# EAGLE design Final (EAGLE 9.6.2)

## Sheet 1 of 6: POWER
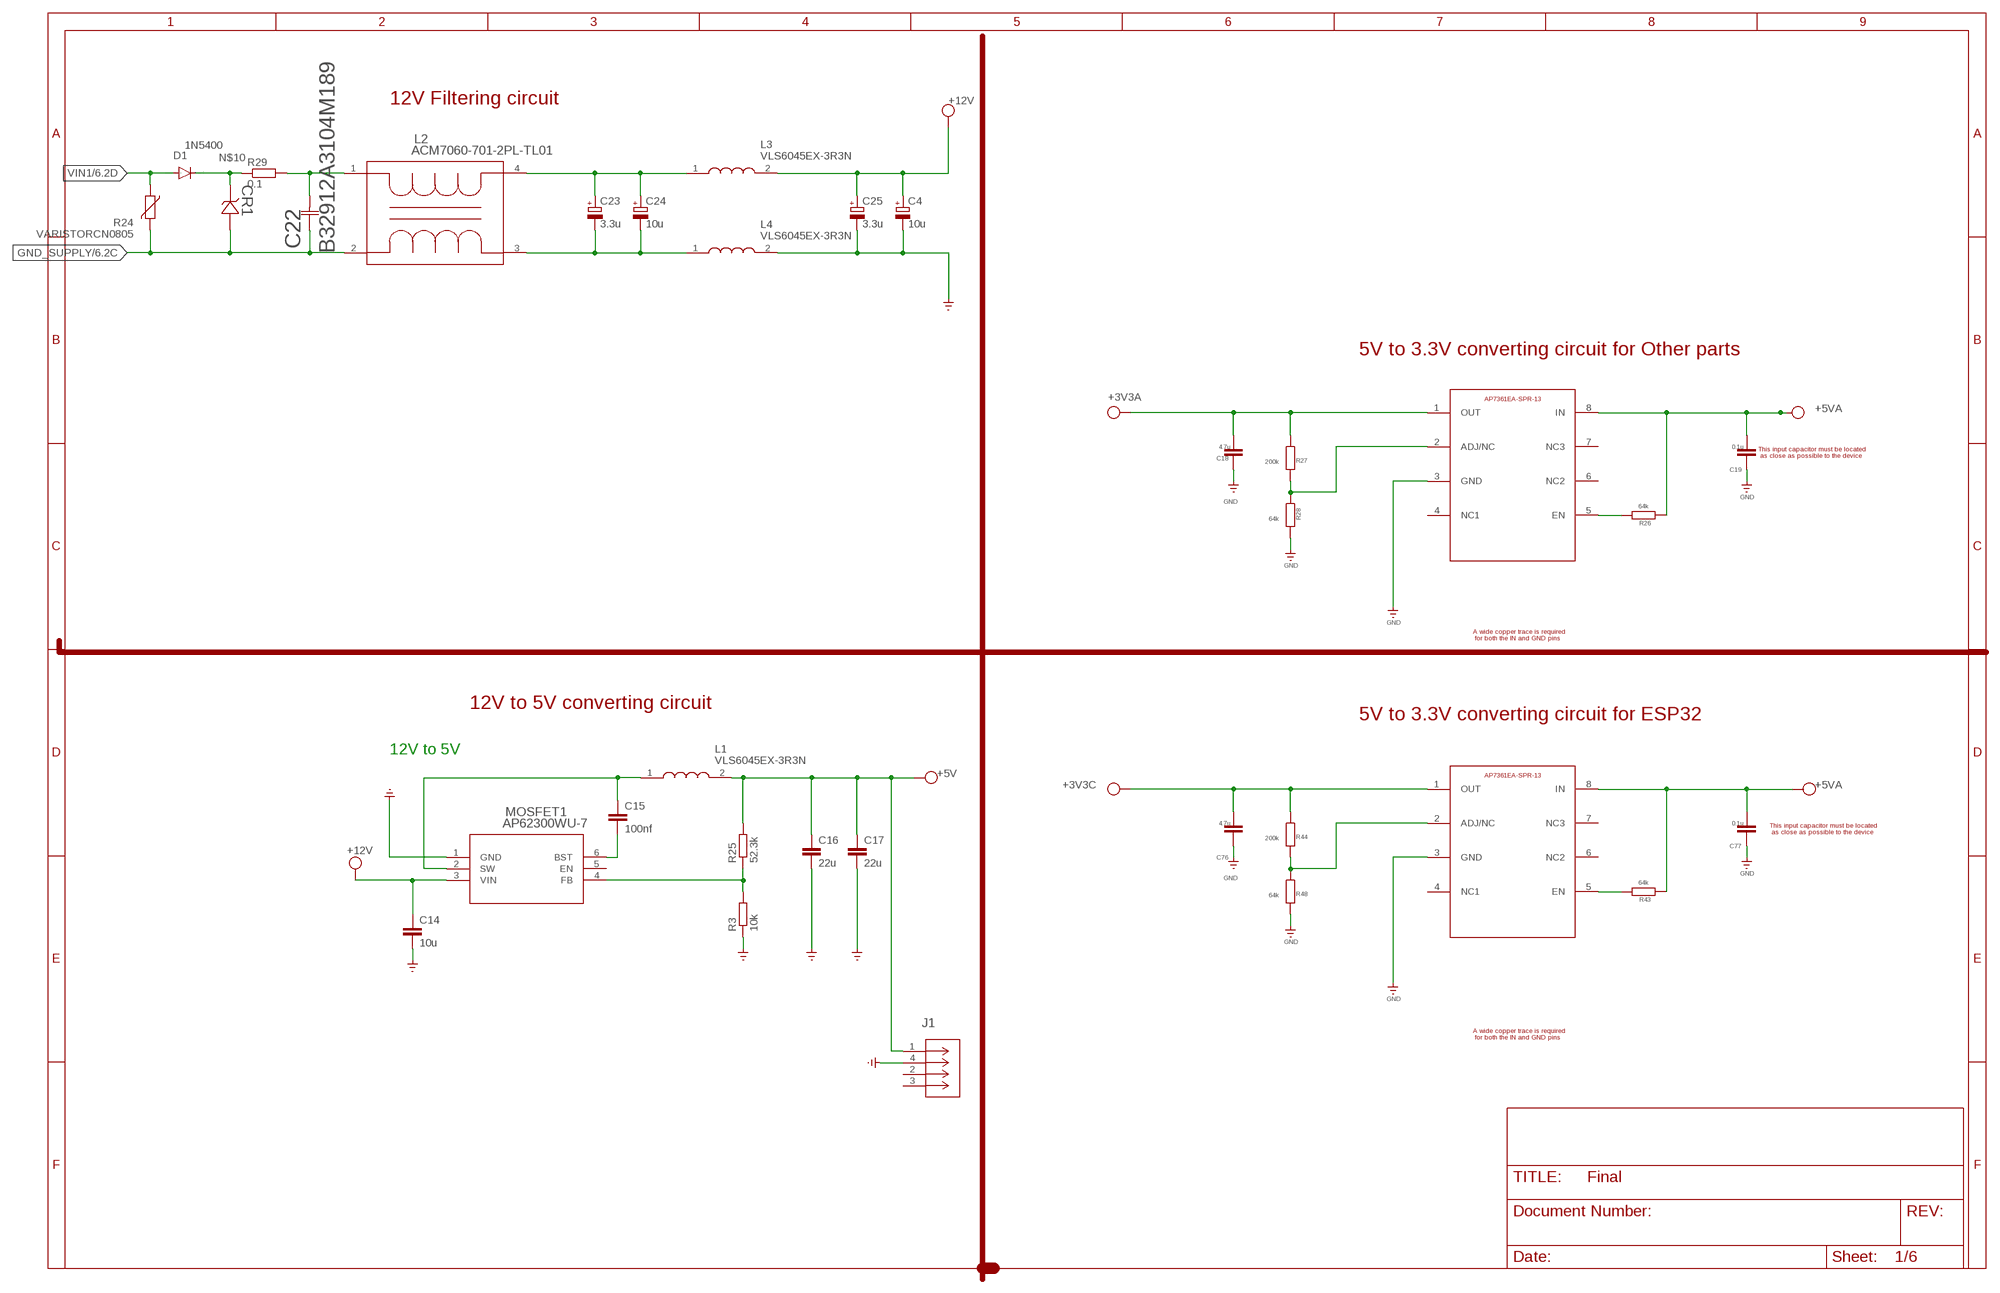
[diagram p0: schematic, sheet 1]

### Parts
C4  10u  CPOL-EUE2.5-5  [E2,5-5]
C14  10u  C-EUC0805  [C0805]
C15  100nf  C-EUC0805  [C0805]
C16  22u  C-EUC0805  [C0805]
C17  22u  C-EUC0805  [C0805]
C18  4.7u  C-EUC0805  [C0805]
C19  0.1u  C-EUC0805  [C0805]
C22  B32912A3104M189  [CAP_B32912A--15--7X12.5X18_TDK]
C23  3.3u  CPOL-EUE2.5-5  [E2,5-5]
C24  10u  CPOL-EUE2.5-5  [E2,5-5]
C25  3.3u  CPOL-EUE2.5-5  [E2,5-5]
C76  4.7u  C-EUC0805  [C0805]
C77  0.1u  C-EUC0805  [C0805]
CR1  SM6T15ASMB_STM-L  [SMB_STM-L]
D1  1N5400  [DO201-15]
J1  USB1130-15-A  [CONN4_USB1130-15-A_GCT]
L1  VLS6045EX-3R3N  [VLS6045]
L2  ACM7060-701-2PL-TL01  [IND_ACM7060_TDK]
L3  VLS6045EX-3R3N  [VLS6045]
L4  VLS6045EX-3R3N  [VLS6045]
MOSFET1  AP62300WU-7  [TSOT26_DIO]
R3  10k  R-EU_R0805  [R0805]
R24  VARISTORCN0805  [CT/CN0805]
R25  52.3k  R-EU_R0805  [R0805]
R26  64k  R-EU_R0805  [R0805]
R27  200k  R-EU_R0805  [R0805]
R28  64k  R-EU_R0805  [R0805]
R29  0.1  R-EU_R1206  [R1206]
R43  64k  R-EU_R0805  [R0805]
R44  200k  R-EU_R0805  [R0805]
R48  64k  R-EU_R0805  [R0805]
U$1  AP7361EASMD  [AP7361EA]
U$12  AP7361EASMD  [AP7361EA]

### Nets
+3V3A: C18.1 R27.1 U$1.1(OUT) ; supply symbol labelled VCC ; also sheet 2,3,4,5,6
+3V3C: C76.1 R44.1 U$12.1(OUT) ; supply symbol labelled VCC ; also sheet 2
+5V: C16.1 C17.1 J1.1 L1.2 R25.2 ; supply symbol labelled VCC ; also sheet 2
+5VA: C19.1 C77.1 R26.1 R43.1 U$1.8(IN) U$12.8(IN) ; supply symbol labelled VCC ; also sheet 2,6
+12V: C4.+ C14.1 C25.+ L3.2 MOSFET1.3(VIN) ; supply symbol labelled VCC ; also sheet 6
GND: C4.- C14.2 C16.2 C17.2 C18.2 C19.2 C25.- C76.2 C77.2 J1.4 L4.2 MOSFET1.1(GND) R3.1 R28.2 R48.2 U$1.3(GND) U$12.3(GND) ; supply symbol labelled SUPPLY0_GND_ ; also sheet 2,3,4,5,6
GND_SUPPLY: C22.1 CR1.2 L2.2 R24.2 ; also sheet 6
N$10: CR1.1 D1.C R29.1
N$12: C23.+ C24.+ L2.4 L3.1
N$14: C23.- C24.- L2.3 L4.1
N$16: MOSFET1.4(FB) R3.2 R25.1
N$17: C15.1 L1.1 MOSFET1.2(SW)
N$18: C15.2 MOSFET1.6(BST)
N$21: R26.2 U$1.5(EN)
N$22: R27.2 R28.1 U$1.2(ADJ/NC)
N$25: R43.2 U$12.5(EN)
N$30: R44.2 R48.1 U$12.2(ADJ/NC)
VIN: C22.2 L2.1 R29.2
VIN1: D1.A R24.1 ; also sheet 6
Unconnected: J1.2 J1.3 MOSFET1.5(EN) U$1.4(NC1) U$1.6(NC2) U$1.7(NC3) U$12.4(NC1) U$12.6(NC2) U$12.7(NC3)

### Notes on the sheet
- 12V Filtering circuit
- 5V to 3.3V converting circuit for Other parts
- This input capacitor must be located
   as close as possible to the device
- A wide copper trace is required
   for both the IN and GND pins
- 12V to 5V converting circuit
- 5V to 3.3V converting circuit for ESP32
- 12V to 5V
- This input capacitor must be located
   as close as possible to the device
- A wide copper trace is required
   for both the IN and GND pins

## Sheet 2 of 6: ESP32
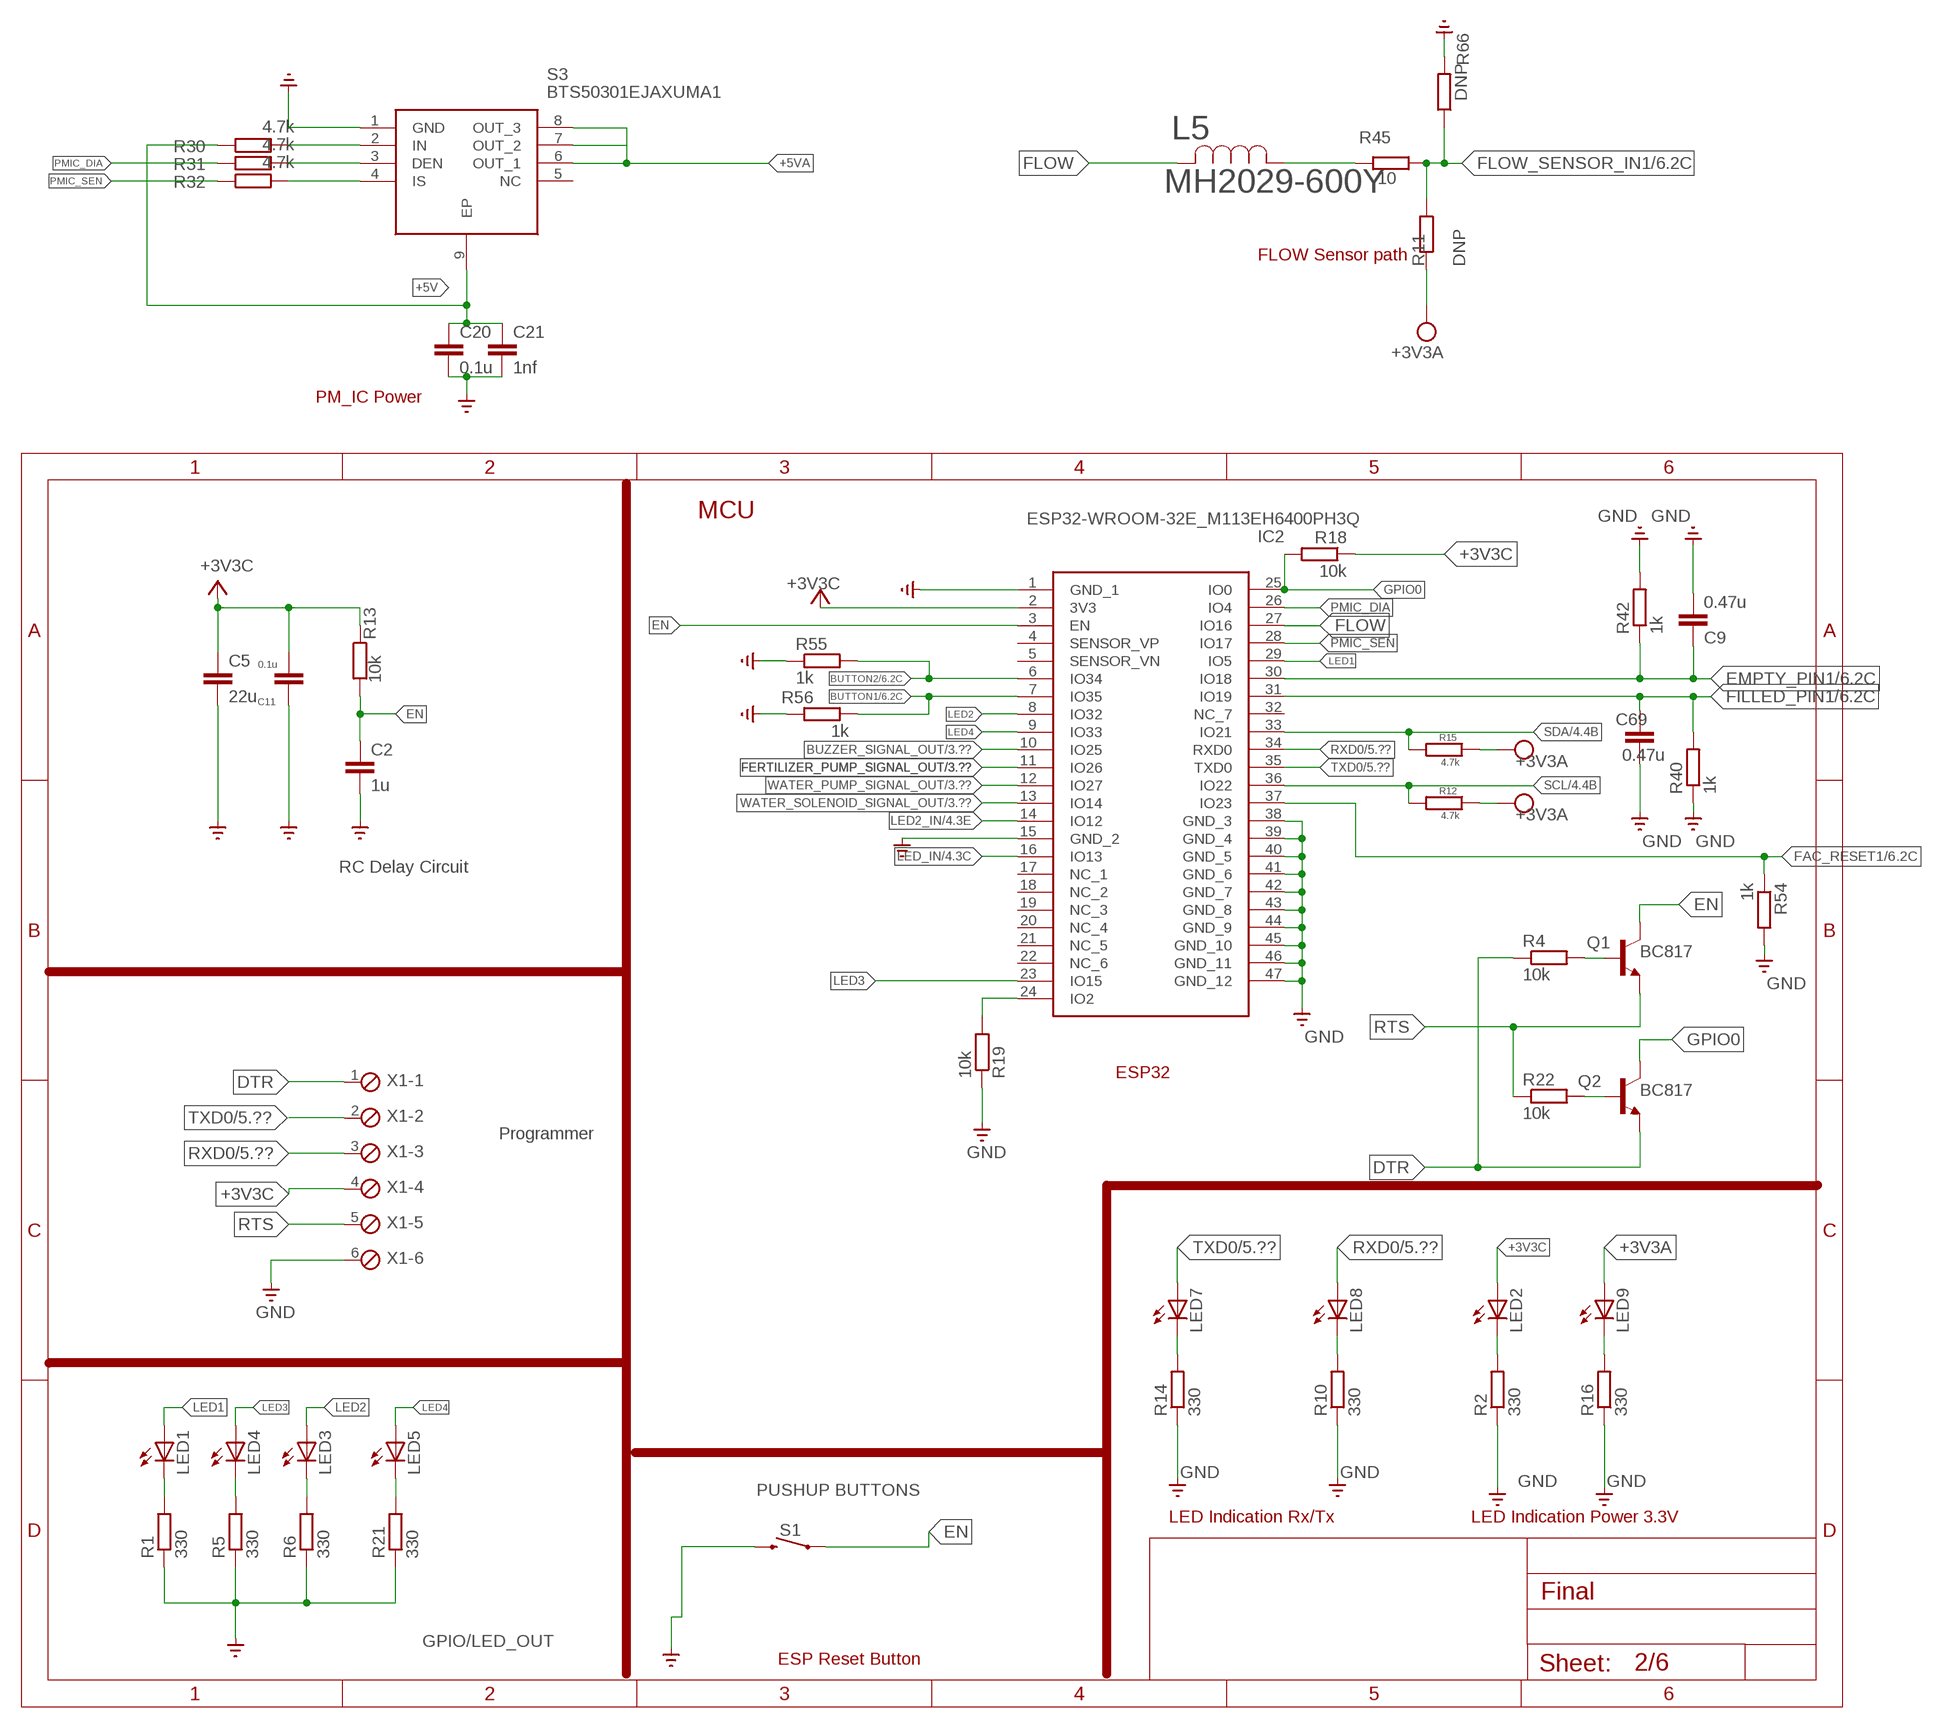
[diagram p1: schematic, sheet 2]

### Parts
C2  1u  C-EUC0805  [C0805]
C5  22u  C-EUC0805  [C0805]
C9  0.47u  C-EUC0805  [C0805]
C11  0.1u  C-EUC0805  [C0805]
C20  0.1u  C-EUC0805  [C0805]
C21  1nf  C-EUC0805  [C0805]
C69  0.47u  C-EUC0805  [C0805]
IC2  ESP32-WROOM-32E_M113EH6400PH3Q  [ESP32WROOM32EM113EH6400PH3Q0]
L5  MH2029-600Y  [IND_BOURNS_MH2029]
LED1  LEDCHIP-LED0603  [CHIP-LED0603]
LED2  LEDCHIP-LED0603  [CHIP-LED0603]
LED3  LEDCHIP-LED0603  [CHIP-LED0603]
LED4  LEDCHIP-LED0603  [CHIP-LED0603]
LED5  LEDCHIP-LED0603  [CHIP-LED0603]
LED7  LEDCHIP-LED0603  [CHIP-LED0603]
LED8  LEDCHIP-LED0603  [CHIP-LED0603]
LED9  LEDCHIP-LED0603  [CHIP-LED0603]
Q1  BC817  [SOT95P230X110-3N]
Q2  BC817  [SOT95P230X110-3N]
R1  330  R-EU_R0805  [R0805]
R2  330  R-EU_R0805  [R0805]
R4  10k  R-EU_R0805  [R0805]
R5  330  R-EU_R0805  [R0805]
R6  330  R-EU_R0805  [R0805]
R10  330  R-EU_R0805  [R0805]
R11  DNP  R-EU_R0805  [R0805]
R12  4.7k  R-EU_R0805  [R0805]
R13  10k  R-EU_R0805  [R0805]
R14  330  R-EU_R0805  [R0805]
R15  4.7k  R-EU_R0805  [R0805]
R16  330  R-EU_R0805  [R0805]
R18  10k  R-EU_R0805  [R0805]
R19  10k  R-EU_R0805  [R0805]
R21  330  R-EU_R0805  [R0805]
R22  10k  R-EU_R0805  [R0805]
R30  4.7k  R-EU_R0805  [R0805]
R31  4.7k  R-EU_R0805  [R0805]
R32  4.7k  R-EU_R0805  [R0805]
R40  1k  R-EU_R0805  [R0805]
R42  1k  R-EU_R0805  [R0805]
R45  10  R-EU_R0805  [R0805]
R54  1k  R-EU_R0805  [R0805]
R55  1k  R-EU_R0805  [R0805]
R56  1k  R-EU_R0805  [R0805]
R66  DNP  R-EU_R0805  [R0805]
S1  MOMENTARY-SWITCH-SPST-SMD-6.2MM-TALL  [TACTILE_SWITCH_SMD_6.2MM_TALL]
S3  BTS50301EJAXUMA1  [SOIC127P600X170-9N]
X1  MPT6  [6POL254]

### Nets
+3V3A: LED9.A R11.2 R12.1 R15.1 ; supply symbol labelled VCC ; also sheet 1,3,4,5,6
+3V3C: C5.1 C11.2 IC2.2(3V3) LED2.A R13.1 R18.1 X1.4 ; supply symbol labelled +3V3 ; also sheet 1
+5V: C20.1 C21.1 R30.1 S3.9(EP) ; also sheet 1
+5VA: S3.6(OUT_1) S3.7(OUT_2) S3.8(OUT_3) ; also sheet 1,6
BUTTON1: IC2.7(IO35) R56.1 ; also sheet 6
BUTTON2: IC2.6(IO34) R55.2 ; also sheet 6
BUZZER_SIGNAL_OUT: IC2.10(IO25) ; also sheet 3
DTR: Q2.2(E) R4.1 X1.1
EMPTY_PIN1: C9.1 IC2.30(IO18) R42.1 ; also sheet 6
EN: C2.1 IC2.3(EN) Q1.3(C) R13.2 S1.A2
FAC_RESET1: IC2.37(IO23) R54.1 ; also sheet 6
FERTILIZER_PUMP_SIGNAL_OUT: IC2.11(IO26) ; also sheet 3,6
FILLED_PIN1: C69.1 IC2.31(IO19) R40.2 ; also sheet 6
FLOW: IC2.27(IO16) L5.2
FLOW_SENSOR_IN1: R11.1 R45.1 R66.1 ; also sheet 6
GND: C2.2 C5.2 C9.2 C11.1 C20.2 C21.2 C69.2 IC2.1(GND_1) IC2.15(GND_2) IC2.38(GND_3) IC2.39(GND_4) IC2.40(GND_5) IC2.41(GND_6) IC2.42(GND_7) IC2.43(GND_8) IC2.44(GND_9) IC2.45(GND_10) IC2.46(GND_11) IC2.47(GND_12) R1.1 R2.1 R5.1 R6.1 R10.1 R14.1 R16.1 R19.1 R21.1 R40.1 R42.2 R54.2 R55.1 R56.2 R66.2 S1.B2 S3.1(GND) X1.6 ; supply symbol labelled SUPPLY0_GND_ ; also sheet 1,3,4,5,6
GPIO0: IC2.25(IO0) Q2.3(C) R18.2
LED1: IC2.29(IO5) LED1.A
LED2: IC2.8(IO32) LED3.A
LED2_IN: IC2.14(IO12) ; also sheet 4
LED3: IC2.23(IO15) LED4.A
LED4: IC2.9(IO33) LED5.A
LED_IN: IC2.16(IO13) ; also sheet 4
N$1: LED2.C R2.2
N$2: LED1.C R1.2
N$3: L5.1 R45.2
N$4: LED3.C R6.2
N$5: Q1.1(B) R4.2
N$6: IC2.24(IO2) R19.2
N$7: LED4.C R5.2
N$8: Q2.1(B) R22.2
N$26: LED5.C R21.2
N$32: R30.2 S3.2(IN)
N$34: R31.2 S3.3(DEN)
N$35: R32.2 S3.4(IS)
N$36: LED7.C R14.2
N$37: LED8.C R10.2
N$42: LED9.C R16.2
PMIC_DIA: IC2.26(IO4) R31.1
PMIC_SEN: IC2.28(IO17) R32.1
RTS: Q1.2(E) R22.1 X1.5
RXD0: IC2.34(RXD0) LED8.A X1.3 ; also sheet 5
SCL: IC2.36(IO22) R12.2 ; also sheet 4,6
SDA: IC2.33(IO21) R15.2 ; also sheet 4,6
TXD0: IC2.35(TXD0) LED7.A X1.2 ; also sheet 5
WATER_PUMP_SIGNAL_OUT: IC2.12(IO27) ; also sheet 3,6
WATER_SOLENOID_SIGNAL_OUT: IC2.13(IO14) ; also sheet 3,6
Unconnected: IC2.4(SENSOR_VP) IC2.5(SENSOR_VN) IC2.17(NC_1) IC2.18(NC_2) IC2.19(NC_3) IC2.20(NC_4) IC2.21(NC_5) IC2.22(NC_6) IC2.32(NC_7) S3.5(NC)

### Notes on the sheet
- FLOW Sensor path
- PM_IC Power
- MCU
- RC Delay Circuit
- ESP32
- Programmer
- PUSHUP BUTTONS
- LED Indication Rx/Tx | LED Indication Power 3.3V
- GPIO/LED_OUT
- ESP Reset Button

## Sheet 3 of 6: Drivers
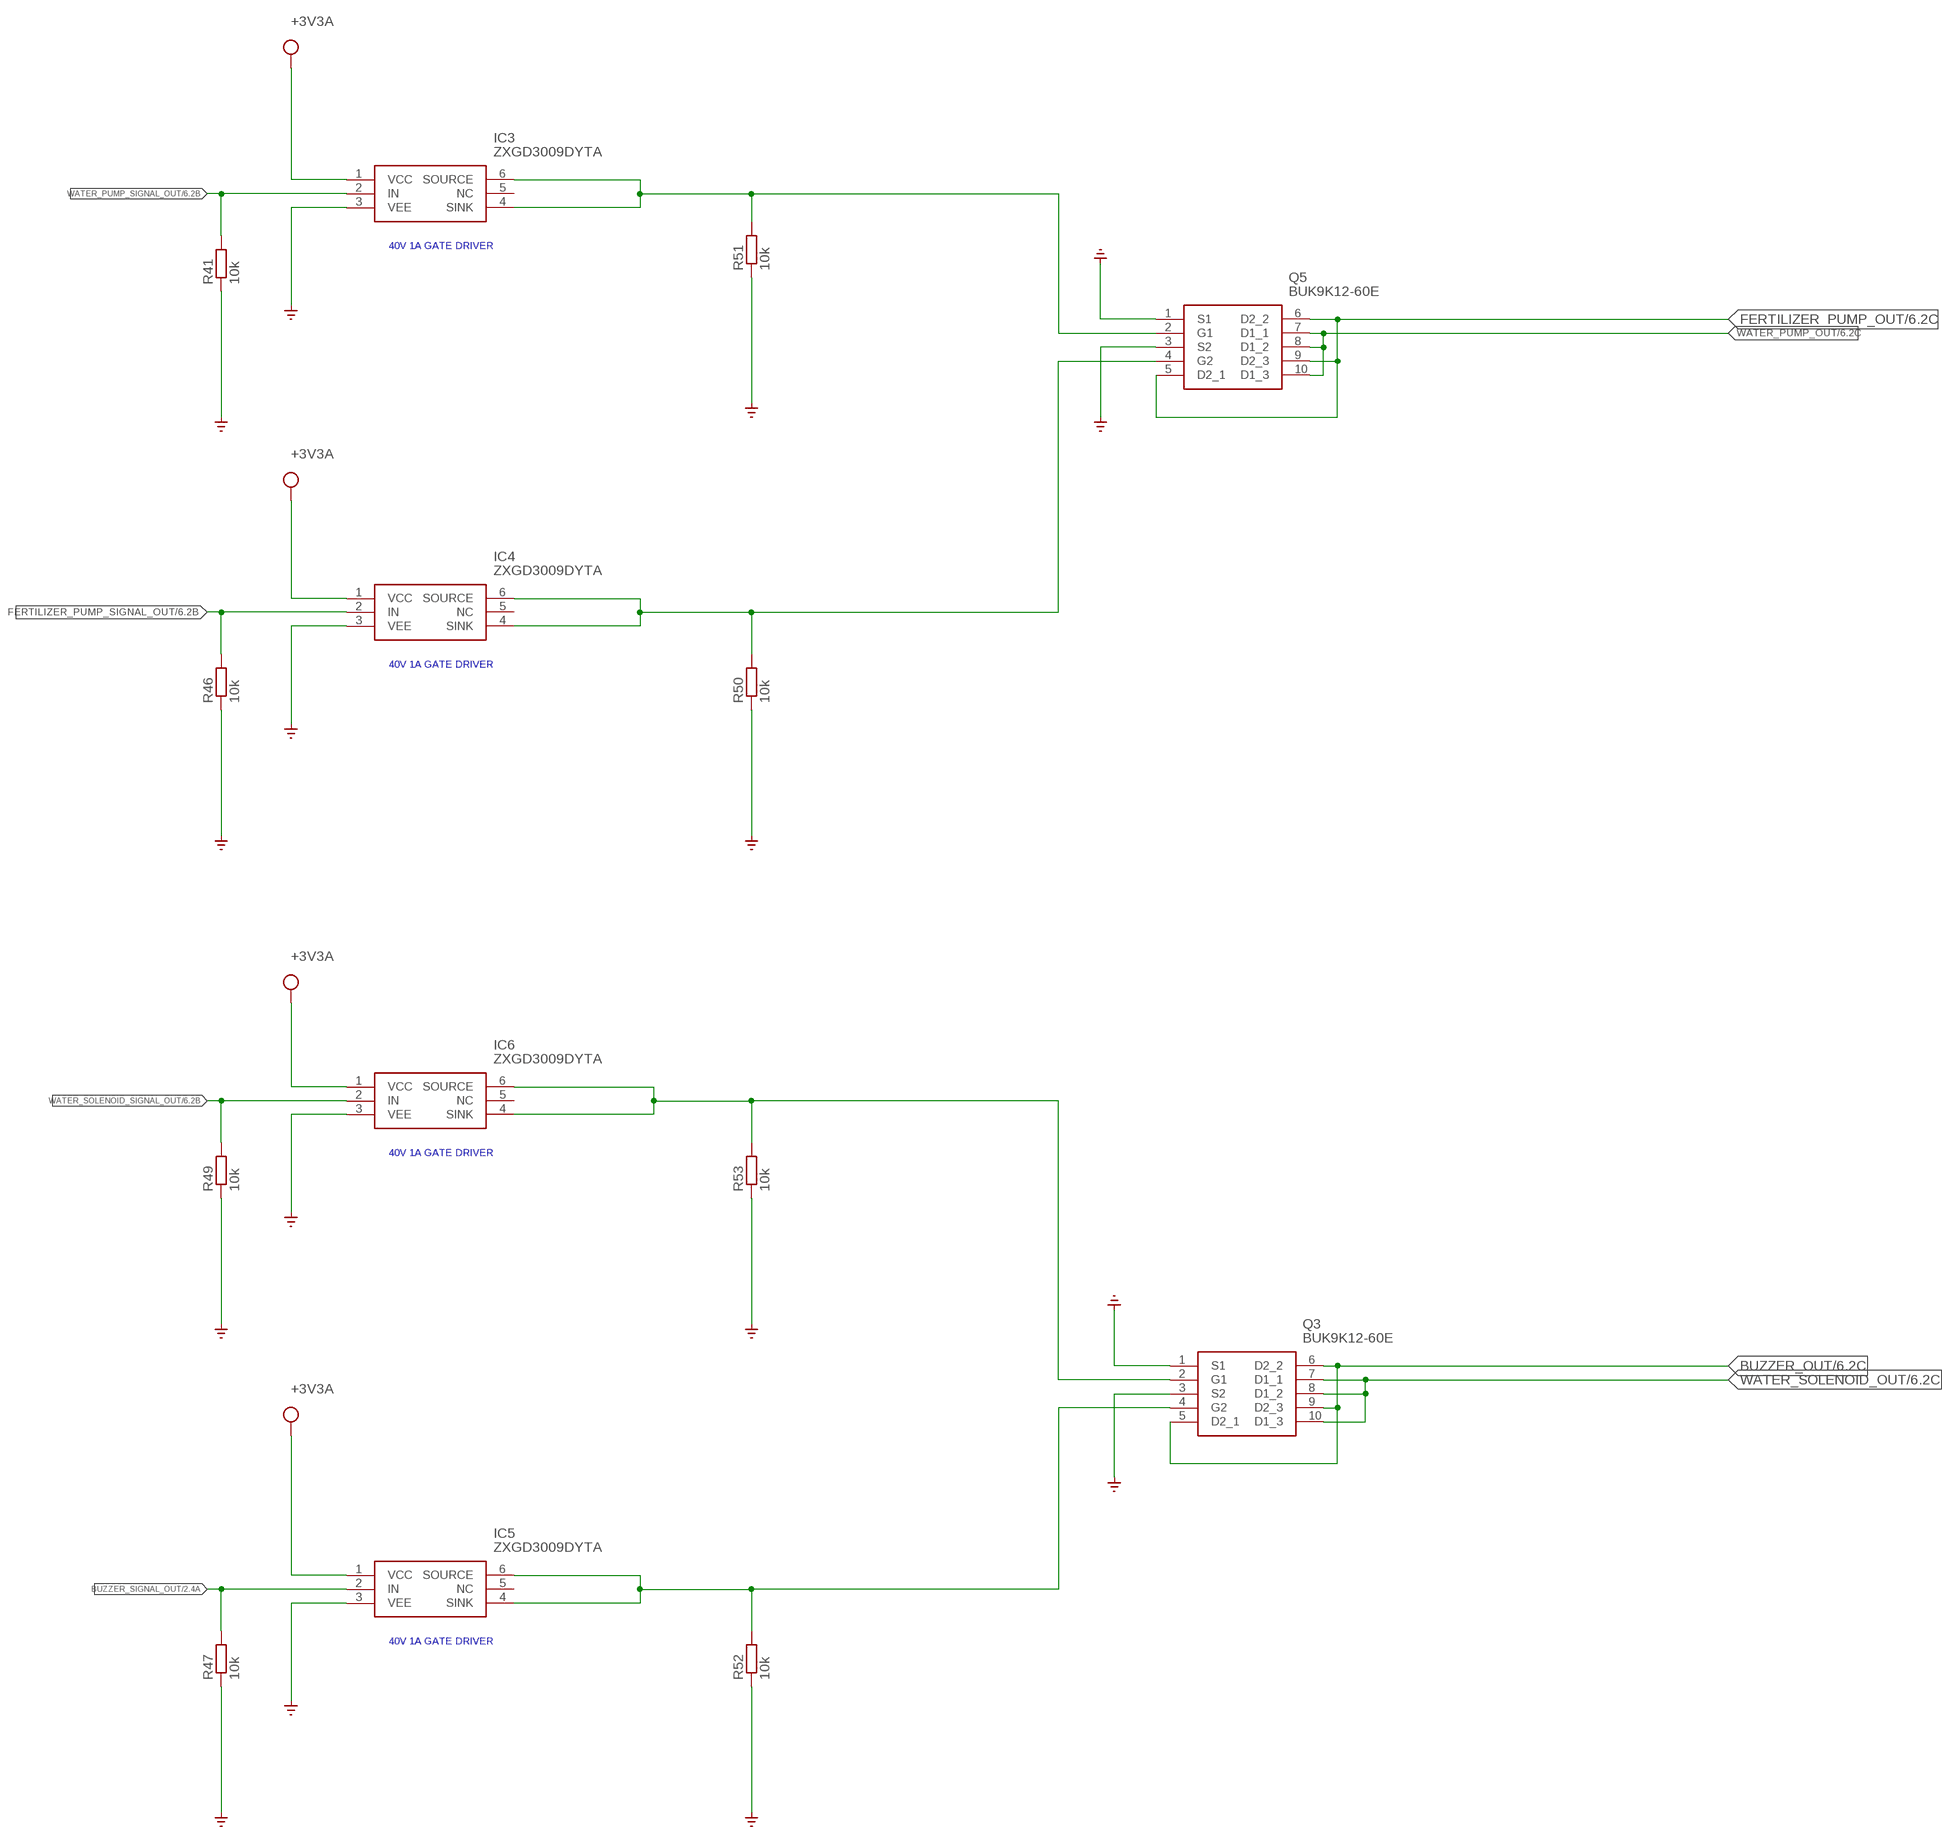
[diagram p2: schematic, sheet 3]

### Parts
IC3  ZXGD3009DYTA  [SOT65P210X110-6N]
IC4  ZXGD3009DYTA  [SOT65P210X110-6N]
IC5  ZXGD3009DYTA  [SOT65P210X110-6N]
IC6  ZXGD3009DYTA  [SOT65P210X110-6N]
Q3  BUK9K12-60E  [BUK9K12-60E]
Q5  BUK9K12-60E  [BUK9K12-60E]
R41  10k  R-EU_R0805  [R0805]
R46  10k  R-EU_R0805  [R0805]
R47  10k  R-EU_R0805  [R0805]
R49  10k  R-EU_R0805  [R0805]
R50  10k  R-EU_R0805  [R0805]
R51  10k  R-EU_R0805  [R0805]
R52  10k  R-EU_R0805  [R0805]
R53  10k  R-EU_R0805  [R0805]

### Nets
+3V3A: IC3.1(VCC) IC4.1(VCC) IC5.1(VCC) IC6.1(VCC) ; supply symbol labelled VCC ; also sheet 1,2,4,5,6
BUZZER_OUT: Q3.5(D2_1) Q3.6(D2_2) Q3.9(D2_3) ; also sheet 6
BUZZER_SIGNAL_OUT: IC5.2(IN) R47.2 ; also sheet 2
FERTILIZER_PUMP_OUT: Q5.5(D2_1) Q5.6(D2_2) Q5.9(D2_3) ; also sheet 6
FERTILIZER_PUMP_SIGNAL_OUT: IC4.2(IN) R46.2 ; also sheet 2,6
GND: IC3.3(VEE) IC4.3(VEE) IC5.3(VEE) IC6.3(VEE) Q3.1(S1) Q3.3(S2) Q5.1(S1) Q5.3(S2) R41.1 R46.1 R47.1 R49.1 R50.1 R51.1 R52.1 R53.1 ; supply symbol labelled SUPPLY0_GND_ ; also sheet 1,2,4,5,6
N$23: IC3.4(SINK) IC3.6(SOURCE) Q5.2(G1) R51.2
N$27: IC4.4(SINK) IC4.6(SOURCE) Q5.4(G2) R50.2
N$31: IC5.4(SINK) IC5.6(SOURCE) Q3.4(G2) R52.2
SOLENOID: IC6.4(SINK) IC6.6(SOURCE) Q3.2(G1) R53.2
WATER_PUMP_OUT: Q5.7(D1_1) Q5.8(D1_2) Q5.10(D1_3) ; also sheet 6
WATER_PUMP_SIGNAL_OUT: IC3.2(IN) R41.2 ; also sheet 2,6
WATER_SOLENOID_OUT: Q3.7(D1_1) Q3.8(D1_2) Q3.10(D1_3) ; also sheet 6
WATER_SOLENOID_SIGNAL_OUT: IC6.2(IN) R49.2 ; also sheet 2,6
Unconnected: IC3.5(NC) IC4.5(NC) IC5.5(NC) IC6.5(NC)

### Notes on the sheet
- 40V 1A GATE DRIVER
- 40V 1A GATE DRIVER
- 40V 1A GATE DRIVER
- 40V 1A GATE DRIVER

## Sheet 4 of 6: RTC Module
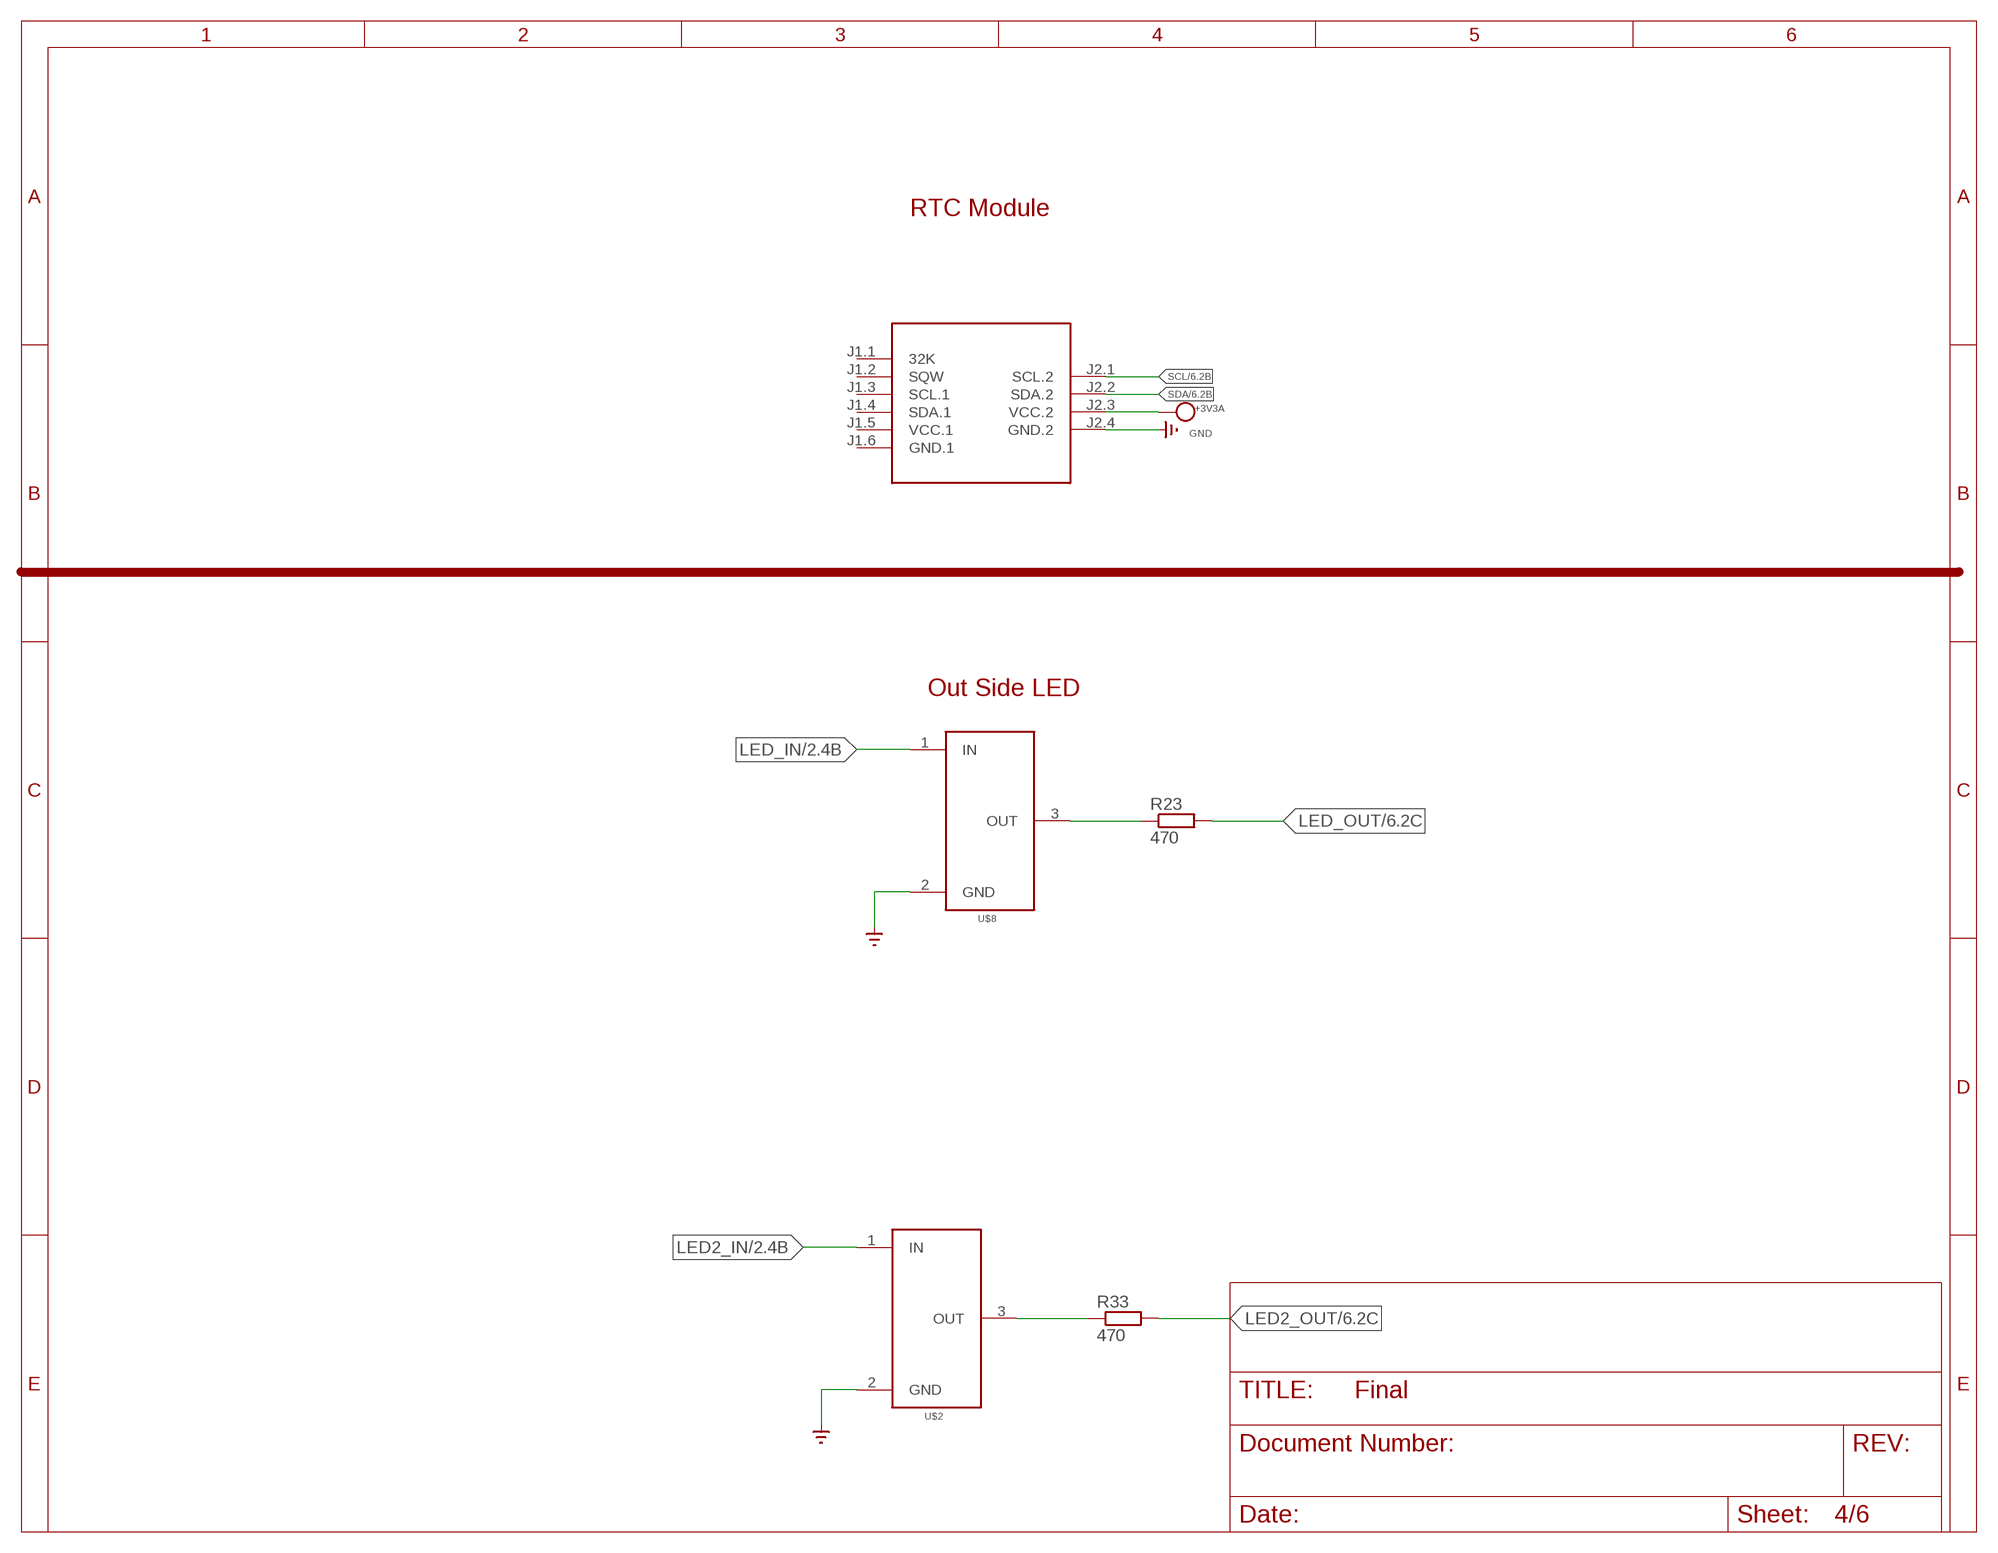
[diagram p3: schematic, sheet 4]

### Parts
R23  470  R-EU_R0805  [R0805]
R33  470  R-EU_R0805  [R0805]
U$2  DDTD113ZC-7-F  [DDTD113ZC-7-F]
U$3  RTC-DS3231-AT24C32  [RTC-DS3231-AT24C32]
U$8  DDTD113ZC-7-F  [DDTD113ZC-7-F]

### Nets
+3V3A: U$3.J2.3(VCC.2) ; supply symbol labelled VCC ; also sheet 1,2,3,5,6
GND: U$2.2(GND) U$3.J2.4(GND.2) U$8.2(GND) ; supply symbol labelled SUPPLY0_GND_ ; also sheet 1,2,3,5,6
LED2_IN: U$2.1(IN) ; also sheet 2
LED2_OUT: R33.2 ; also sheet 6
LED_IN: U$8.1(IN) ; also sheet 2
LED_OUT: R23.2 ; also sheet 6
N$11: R23.1 U$8.3(OUT)
N$15: R33.1 U$2.3(OUT)
SCL: U$3.J2.1(SCL.2) ; also sheet 2,6
SDA: U$3.J2.2(SDA.2) ; also sheet 2,6
Unconnected: U$3.J1.1(32K) U$3.J1.2(SQW) U$3.J1.3(SCL.1) U$3.J1.4(SDA.1)

### Notes on the sheet
- RTC Module
- Out Side LED

## Sheet 5 of 6: RS485 Auto Tranresiver
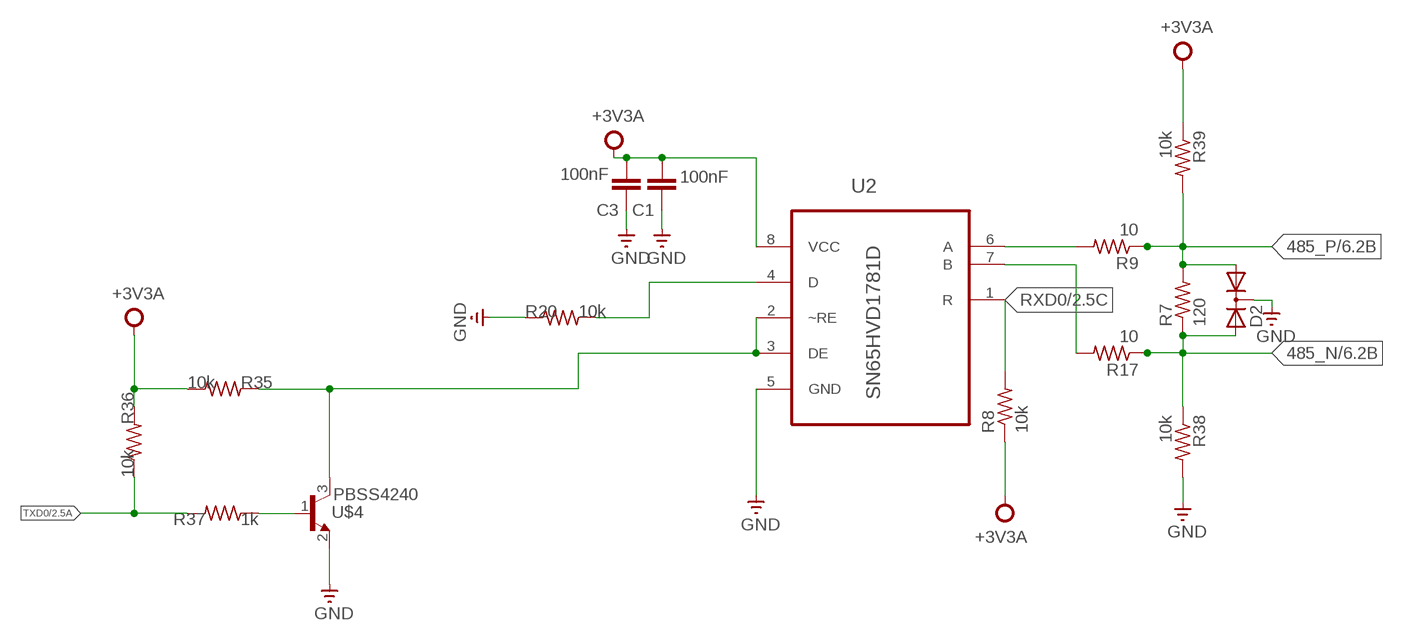
[diagram p4: schematic, sheet 5]

### Parts
C1  100nF  C-EUC0805  [C0805]
C3  100nF  C-EUC0805  [C0805]
D2  DIODE-2AC|CASOT23  [SOT23]
R7  120  R-US_R0805  [R0805]
R8  10k  R-US_R0805  [R0805]
R9  10  R-US_R0805  [R0805]
R17  10  R-US_R0805  [R0805]
R20  10k  R-US_R0805  [R0805]
R35  10k  R-US_R0805  [R0805]
R36  10k  R-US_R0805  [R0805]
R37  1k  R-US_R0805  [R0805]
R38  10k  R-US_R0805  [R0805]
R39  10k  R-US_R0805  [R0805]
U2  SN65HVD1781D  [SOIC127P600X175-8N]
U$4  PBSS4240  [SOT23]

### Nets
485_N [New Class]: D2.2(A2) R7.1 R17.1 R38.1 ; also sheet 6
485_P [New Class]: D2.1(A1) R7.2 R9.1 R39.2 ; also sheet 6
+3V3A: C1.2 C3.2 R8.1 R35.1 R36.2 R39.1 U2.8(VCC) ; also sheet 1,2,3,4,6
GND: C1.1 C3.1 D2.3(C) R20.1 R38.2 U2.5(GND) U$4.2(E) ; also sheet 1,2,3,4,6
N$9: R9.2 U2.6(A)
N$13: R17.2 U2.7(B)
N$19: R20.2 U2.4(D)
N$20: R35.2 U2.2(~RE) U2.3(DE) U$4.3(C)
N$24: R37.1 U$4.1(B)
RXD0: R8.2 U2.1(R) ; also sheet 2
TXD0: R36.1 R37.2 ; also sheet 2

## Sheet 6 of 6: Connectors
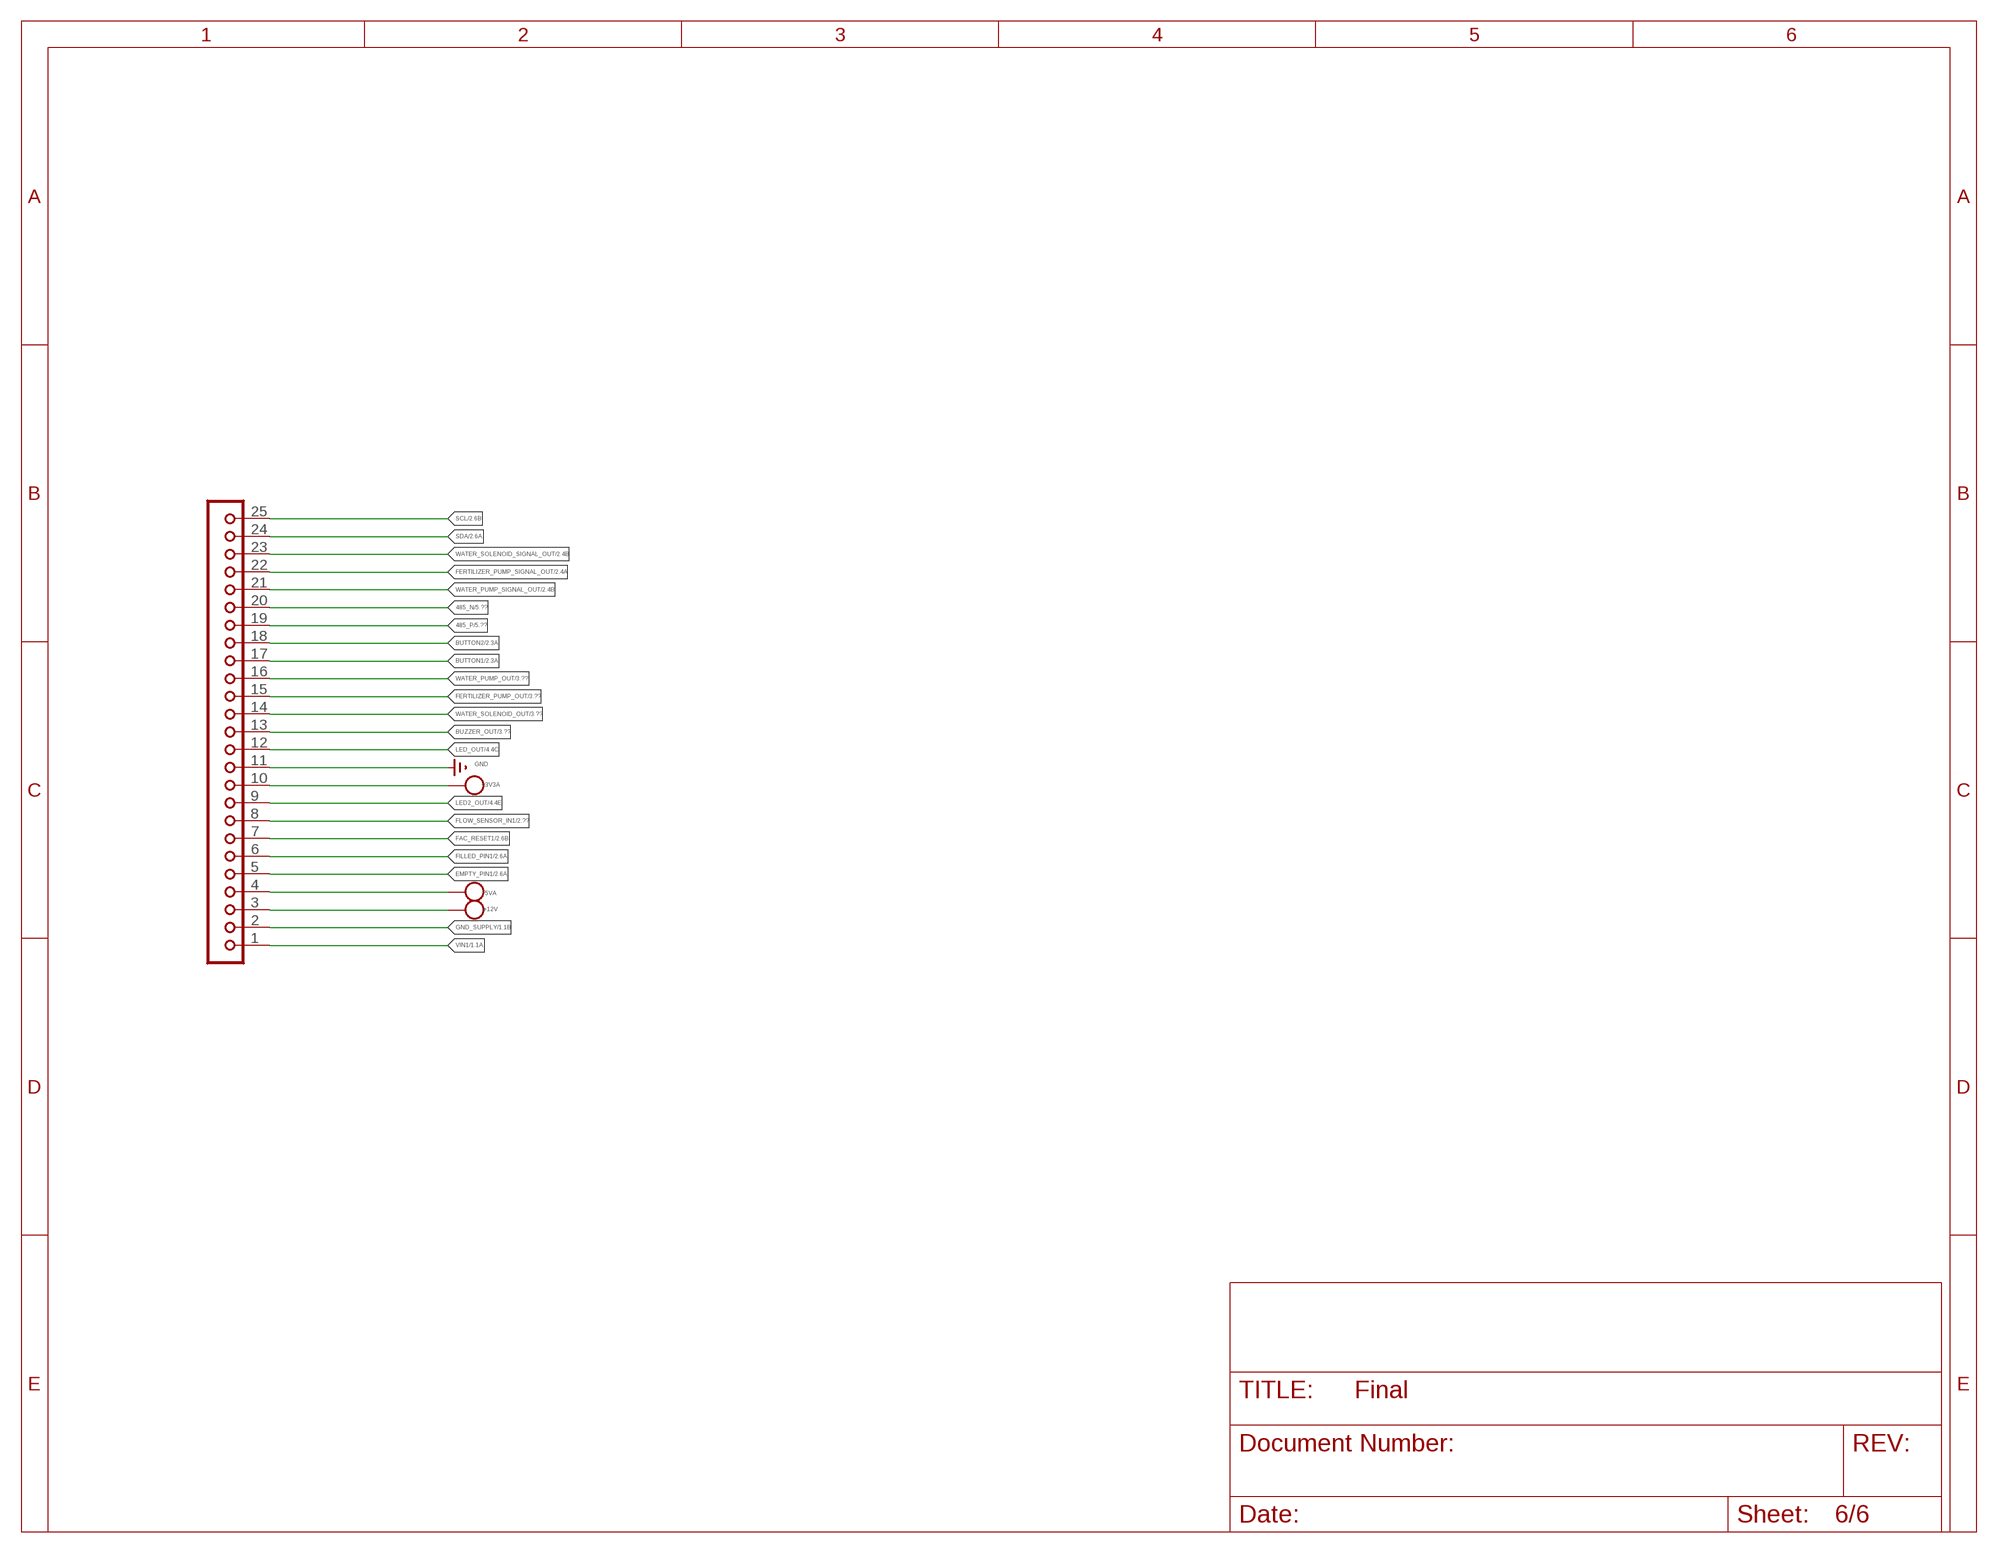
[diagram p5: schematic, sheet 6]

### Parts
J2  JBK20L  [JBK20L]

### Nets
485_N [New Class]: J2.20 ; also sheet 5
485_P [New Class]: J2.19 ; also sheet 5
+3V3A: J2.10 ; supply symbol labelled VCC ; also sheet 1,2,3,4,5
+5VA: J2.4 ; supply symbol labelled VCC ; also sheet 1,2
+12V: J2.3 ; supply symbol labelled VCC ; also sheet 1
BUTTON1: J2.17 ; also sheet 2
BUTTON2: J2.18 ; also sheet 2
BUZZER_OUT: J2.13 ; also sheet 3
EMPTY_PIN1: J2.5 ; also sheet 2
FAC_RESET1: J2.7 ; also sheet 2
FERTILIZER_PUMP_OUT: J2.15 ; also sheet 3
FERTILIZER_PUMP_SIGNAL_OUT: J2.22 ; also sheet 2,3
FILLED_PIN1: J2.6 ; also sheet 2
FLOW_SENSOR_IN1: J2.8 ; also sheet 2
GND: J2.11 ; supply symbol labelled SUPPLY0_GND_ ; also sheet 1,2,3,4,5
GND_SUPPLY: J2.2 ; also sheet 1
LED2_OUT: J2.9 ; also sheet 4
LED_OUT: J2.12 ; also sheet 4
SCL: J2.25 ; also sheet 2,4
SDA: J2.24 ; also sheet 2,4
VIN1: J2.1 ; also sheet 1
WATER_PUMP_OUT: J2.16 ; also sheet 3
WATER_PUMP_SIGNAL_OUT: J2.21 ; also sheet 2,3
WATER_SOLENOID_OUT: J2.14 ; also sheet 3
WATER_SOLENOID_SIGNAL_OUT: J2.23 ; also sheet 2,3

## Power pins joined to a net without a drawn wire
GND.1: U$3.J1.6(GND.1)
VCC.1: U$3.J1.5(VCC.1)

## Library data of the parts
C1 C3 = resistor:C-EU: CAPACITOR, European symbol; OC_NEWARK: unknown
C2 C5 C9 C11 C14-C21 C69 C76 C77 = rcl:C-EU: CAPACITOR, European symbol; SPICEPREFIX: C
C4 C23-C25 = rcl:CPOL-EU: POLARIZED CAPACITOR, European symbol; SPICEPREFIX: C
C22 = B32912A3104M189:B32912A3104M189; COPYRIGHT: Copyright (C) 2023 Ultra Librarian. All rights reserved.; DIGI-KEY_PART_NUMBER_1: 495-77179-2-ND; DIGI-KEY_PART_NUMBER_2: 495-77179-1-ND; MANUFACTURER_PART_NUMBER: B32912A3104M189; MFR_NAME: TDK
CR1 = SM6T15A:SM6T15A; COPYRIGHT: Copyright (C) 2023 Ultra Librarian. All rights reserved.; MANUFACTURER_PART_NUMBER: SM6T15A; MFR_NAME: STMicroelectronics
D1 = diode:1N5400: DIODE standard rectifier, 3 A, 50 V (Motorola)
D2 = diode:DIODE-2AC|CA: Dual DIODE Anode-Cathode|Cathode-Anode
IC2 = ESP32-WROOM-32E_M113EH6400PH3Q:ESP32-WROOM-32E_M113EH6400PH3Q: WiFi Modules (802.11) SMD Module ESP32-WROOM-32E, ESP32-D0WD-V3, 8 MB SPI flash, PCB antenna Source: Datasheet; DESCRIPTION: WiFi Modules (802.11) SMD Module ESP32-WROOM-32E, ESP32-D0WD-V3, 8 MB SPI flash, PCB antenna; HEIGHT: 3.25mm; MANUFACTURER_NAME: Espressif Systems; MANUFACTURER_PART_NUMBER: ESP32-WROOM-32E(M113EH6400PH3Q0); MOUSER_PART_NUMBER: 356-ESP32WRM32E164PH; MOUSER_PRICE-STOCK: https://www.mouser.co.uk/ProductDetail/Espressif-Systems/ESP32-WROOM-32EM113EH6400PH3Q0?qs=vHuUswq2%252BsyxOqk%2FssPEaA%3D%3D
IC3-IC6 = ZXGD3009DYTA:ZXGD3009DYTA: DiodesZetex ZXGD3009DYTA, Dual Non-Inverting Buffer, Maximum of 40 V, 6-Pin SOT-363 Source: Datasheet; ARROW_PART_NUMBER: ZXGD3009DYTA; ARROW_PRICE-STOCK: https://www.arrow.com/en/products/zxgd3009dyta/diodes-incorporated?region=nac; DESCRIPTION: DiodesZetex ZXGD3009DYTA, Dual Non-Inverting Buffer, Maximum of 40 V, 6-Pin SOT-363; HEIGHT: 1.1mm; MANUFACTURER_NAME: Diodes Inc.; MANUFACTURER_PART_NUMBER: ZXGD3009DYTA; MOUSER_PART_NUMBER: 621-ZXGD3009DYTA; MOUSER_PRICE-STOCK: https://www.mouser.co.uk/ProductDetail/Diodes-Incorporated/ZXGD3009DYTA?qs=asCBFxFfL1QEwXEeEjwPgg%3D%3D
J1 = USB_typeA:USB1130-15-A; COPYRIGHT: Copyright (C) 2023 Ultra Librarian. All rights reserved.; MANUFACTURER_PART_NUMBER: USB1130-15-A; MFR_NAME: Global Connector Technology
J2 = Drip_Iriigation_pin:JBK20L: PIN HEADER; OC_FARNELL: unknown; OC_NEWARK: unknown
L1 L3 L4 = VLS6045EX-3R3N:VLS6045EX-3R3N: TDK VLS-EX Series Type 6045 Shielded Wire-wound SMD Inductor with a Ferrite Core, 3.3 uH +/-30% Wire-Wound 4.95A Idc Source: Datasheet; ARROW_PART_NUMBER: VLS6045EX-3R3N; ARROW_PRICE-STOCK: https://www.arrow.com/en/products/vls6045ex-3r3n/tdk?region=europe; DESCRIPTION: TDK VLS-EX Series Type 6045 Shielded Wire-wound SMD Inductor with a Ferrite Core, 3.3 uH +/-30% Wire-Wound 4.95A Idc; HEIGHT: mm; MANUFACTURER_NAME: TDK; MANUFACTURER_PART_NUMBER: VLS6045EX-3R3N; MOUSER_PART_NUMBER: 810-VLS6045EX-3R3N; MOUSER_PRICE-STOCK: https://www.mouser.co.uk/ProductDetail/TDK/VLS6045EX-3R3N?qs=oF%2FSscNnLpBDsR5zLEzLQg%3D%3D
L2 = ACM7060-701-2PL-TL01:ACM7060-701-2PL-TL01; COPYRIGHT: Copyright (C) 2023 Ultra Librarian. All rights reserved.; DIGI-KEY_PART_NUMBER_1: 445-2215-1-ND; DIGI-KEY_PART_NUMBER_2: 445-2215-2-ND; DIGI-KEY_PART_NUMBER_3: 445-2215-2-NDL; DIGI-KEY_PART_NUMBER_4: 445-2215-6-ND; MANUFACTURER_PART_NUMBER: ACM7060-701-2PL-TL01; MFR_NAME: TDK
L5 = MH2029-600Y:MH2029-600Y; COPYRIGHT: Copyright (C) 2023 Ultra Librarian. All rights reserved.; MANUFACTURER_PART_NUMBER: MH2029-600Y; MFR_NAME: Bourns Electronics
LED1-LED5 LED7-LED9 = adafruit:LED: LED OSRAM: - CHIPLED LG R971, LG N971, LY N971, LG Q971, LY Q971, LO R971, LY R971 LH N974, LH R974 LS Q976, LO Q976, LY Q976 LO Q996 - Hyper CHIPLED LW Q18S LB Q993, LB Q99A, LB R99A - SideLED LS A670, LO A670, LY A670, LG A670, LP A670 LB A673, LV A673, LT A673, LW A673 LH A674 LY A675 LS A676, LA A676, LO A676, LY A676, LW A676 LS A679, LY A679, LG A679 - Hyper Micro SIDELED® LS Y876, LA Y876, LO Y876, LY Y876 LT Y87S - SmartLED LW L88C, LW L88S LB L89C, LB L89S, LG L890 LS L89K, LO L89K, LY L89K LS L896, LA L896, LO L896, LY L896 - TOPLED LS T670, LO T670, LY T670, LG T670, LP T670 LSG T670, LSP T670, LSY T670, LOP T670, LYG T670 LG T671, LOG T671, LSG T671 LB T673, LV T673, LT T673, LW T673 LH T674 LS T676, LA T676, LO T676, LY T676, LB T676, LH T676, LSB T676, LW T676 LB T67C, LV T67C, LT T67C, LS T67K, LO T67K, LY T67K, LW E67C LS E67B, LA E67B, LO E67B, LY E67B, LB E67C, LV E67C, LT E67C LW T67C LS T679, LY T679, LG T679 LS T770, LO T770, LY T770, LG T770, LP T770 LB T773, LV T773, LT T773, LW T773 LH T774 LS E675, LA E675, LY E675, LS T675 LS T776, LA T776, LO T776, LY T776, LB T776 LHGB T686 LT T68C, LB T68C - Hyper Mini TOPLED® LB M676 - Mini TOPLED Santana® LG M470 LS M47K, LO M47K, LY M47K Source: http://www.osram.convergy.de/
MOSFET1 = AP62300WU-7:AP62300WU-7; COPYRIGHT: Copyright (C) 2023 Ultra Librarian. All rights reserved.; DIGI-KEY_PART_NUMBER_1: 31-AP62300WU-7TR-ND; DIGI-KEY_PART_NUMBER_2: 31-AP62300WU-7CT-ND; DIGI-KEY_PART_NUMBER_3: 31-AP62300WU-7DKR-ND; MANUFACTURER_PART_NUMBER: AP62300WU-7; MFR_NAME: Diodes Inc
Q1 Q2 = BC817:BC817: Transistor, Npn, 0.5a, 45v, Sot23 Check availability; AVAILABILITY: In Stock; DESCRIPTION: Bipolar (BJT) Transistor NPN 45V 500mA 100MHz 250mW Surface Mount TO-236AB; MF: Rectron; MP: BC817; PACKAGE: SOT-23-3 Rectron; PRICE: None
Q3 Q5 = BUK9K13-60RAX:BUK9K12-60E: Mosfet Array 2 N-Channel (Dual) 60V 40A (Ta) 64W (Ta) Surface Mount LFPAK56D Source: Datasheet; ARROW_PART_NUMBER: BUK9K13-60RAX; ARROW_PRICE-STOCK: https://www.arrow.com/en/products/buk9k13-60rax/nexperia?region=nac; DESCRIPTION: Mosfet Array 2 N-Channel (Dual) 60V 40A (Ta) 64W (Ta) Surface Mount LFPAK56D; HEIGHT: 1.15mm; MANUFACTURER_NAME: Nexperia; MANUFACTURER_PART_NUMBER: BUK9K13-60RAX; MOUSER_PART_NUMBER: 771-BUK9K13-60RAX; MOUSER_PRICE-STOCK: https://www.mouser.co.uk/ProductDetail/Nexperia/BUK9K13-60RAX?qs=KUoIvG%2F9IlalgRWhHGyONg%3D%3D
R1-R6 R10-R16 R18 R19 R21-R23 R25-R33 R40-R56 R66 = rcl:R-EU_: RESISTOR, European symbol; SPICEPREFIX: R
R7-R9 R17 R20 R35-R39 = resistor:R-US_: RESISTOR, American symbol
R24 = varistor:VARISTOR: VARISTOR
S1 = SparkFun-Switches:MOMENTARY-SWITCH-SPST: Momentary Switch (Pushbutton) - SPST Normally-open (NO) SPST momentary switches (buttons, pushbuttons). Variants PTH-12MM - 12mm square, through-hole Momentary Pushbutton Switch - 12mm Square (COM-09190) PTH-6.0MM, PTH-6.0MM-KIT - 6.0mm square, through-hole Mini Pushbutton Switch (COM-00097) KIT package intended for soldering kit's - only one side of pads' copper is exposed. PTH-RIGHT-ANGLE-KIT - Right-angle, through-hole Right Angle Tactile Button - Used on SparkFun BigTime Watch Kit SMD-12MM - 12mm square, surface-mount Tactile Button - SMD (12mm) (COM-12993) Used on SparkFun PicoBoard SMD-4.5MM - 4.5mm Square Trackball Switch Used on SparkFun Blackberry Trackballer Breakout SMD-4.6MMX2.8MM - 4.60mm x 2.80mm, surface mount Used on SparkFun SAMD21 Mini Breakout SMD-5.2MM, SMD-5.2-REDUNDANT - 5.2mm square, surface-mount Mini Pushbutton Switch - SMD (COM-08720) Used on Arduino Pro Mini REDUNDANT package connects both switch circuits together SMD-6.0X3.5MM - 6.0 x 3.5mm, surface mount Momentary Reset Switch SMD (COM-08229) SMD-6.2MM-TALL - 6.2mm square, surface mount Tactile Button - SMD (6mm) Used on SparkFun Digital Sandbox SMD-RIGHT-ANGLE - Right-angle, surface mount Used on SparkFun Block for Intel® Edison - Arduino; PROD_ID: SWCH-11966; SF_SKU: COM-12992
S3 = BTS50301EJAXUMA1:BTS50301EJAXUMA1: Current Limit SW 1-IN 1-OUT 5V to 28V 5A Automotive 8-Pin DSO EP T/R Source: Datasheet; ARROW_PART_NUMBER: BTS50301EJAXUMA1; ARROW_PRICE-STOCK: https://www.arrow.com/en/products/bts50301ejaxuma1/infineon-technologies-ag; DESCRIPTION: Current Limit SW 1-IN 1-OUT 5V to 28V 5A Automotive 8-Pin DSO EP T/R; HEIGHT: 1.7mm; MANUFACTURER_NAME: Infineon; MANUFACTURER_PART_NUMBER: BTS50301EJAXUMA1; MOUSER_PART_NUMBER: 726-BTS50301EJAXUMA1; MOUSER_PRICE-STOCK: https://www.mouser.co.uk/ProductDetail/Infineon-Technologies/BTS50301EJAXUMA1?qs=OwbwYO03UsJxxUPqIvrk2w%3D%3D
U2 = Texas Instruments_By_element14_Batch_1:SN65HVD1781D: Fault-Protected RS-485 Transceivers with 3.3-V to 5-V Operation; MPN: SN65HVD1781D; OC_FARNELL: 1703343; OC_NEWARK: 85M0100; PACKAGE: SOIC-8; SUPPLIER: Texas Instruments
U$1 U$12 = AP7361EA:AP7361EA
U$2 U$8 = DDTD113ZC-7-F:DDTD113ZC-7-F: NPN PRE-BIASED 500mA SURFACE MOUNT TRANSISTOR
U$3 = diy-modules:RTC-DS3231-AT24C32: RTC Module with Battery and EEPROM based on DS3231 and AT24C32 chips Tutorial can be found here: https://edwardmallon.wordpress.com/2014/05/21/using-a-cheap-3-ds3231-rtc-at24c32-eeprom-from-ebay/ Click here to find device on ebay.com
U$4 = transistor_x:PBSS4240
X1 = con-phoenix-254:MPT6: PHOENIX CONNECTOR; OC_FARNELL: unknown; OC_NEWARK: unknown

## Board
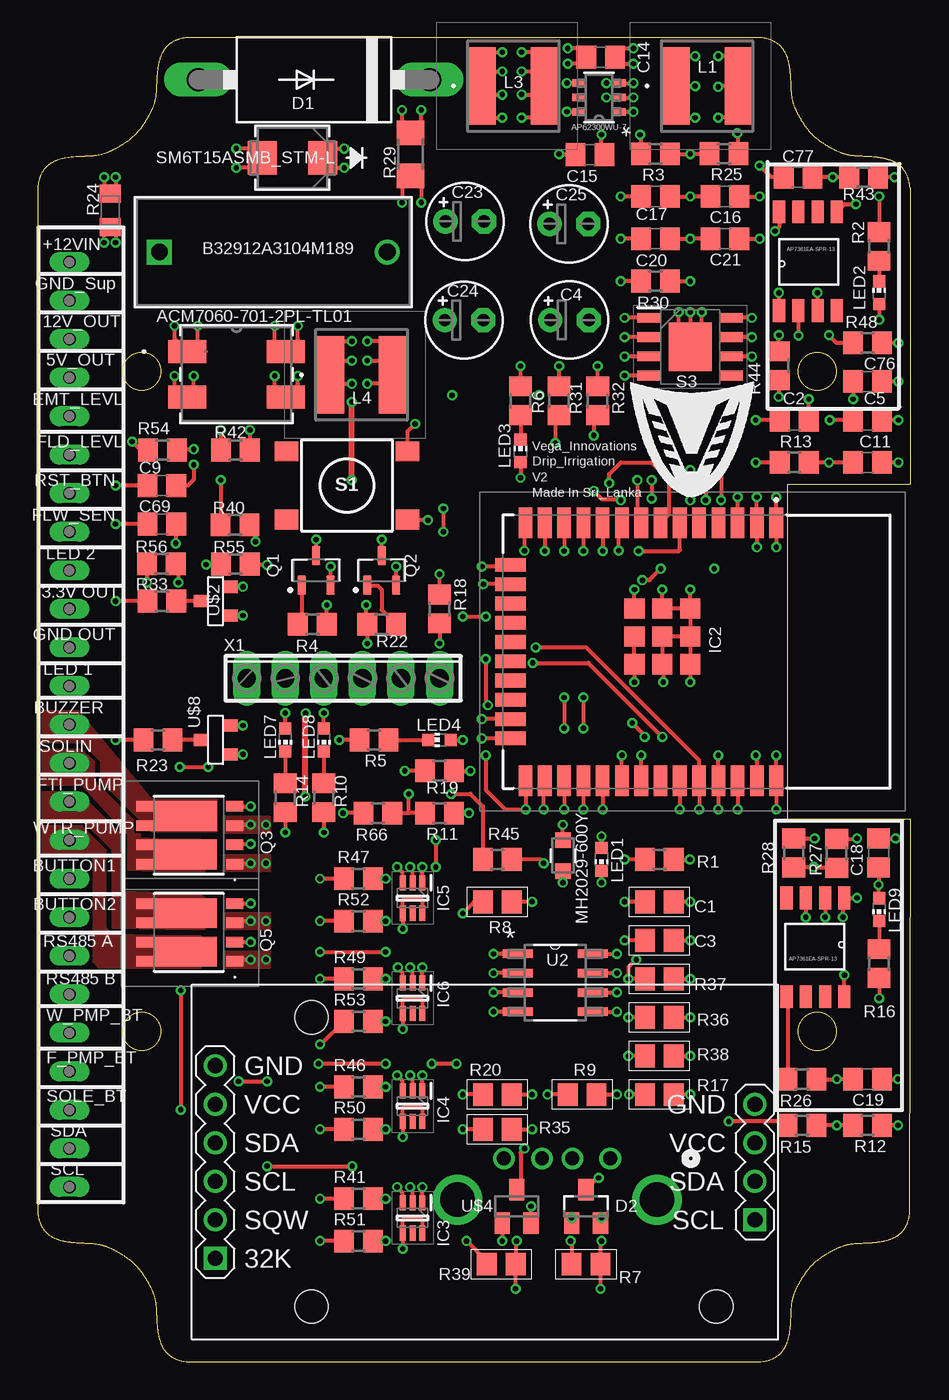
[diagram p6: board, top side]
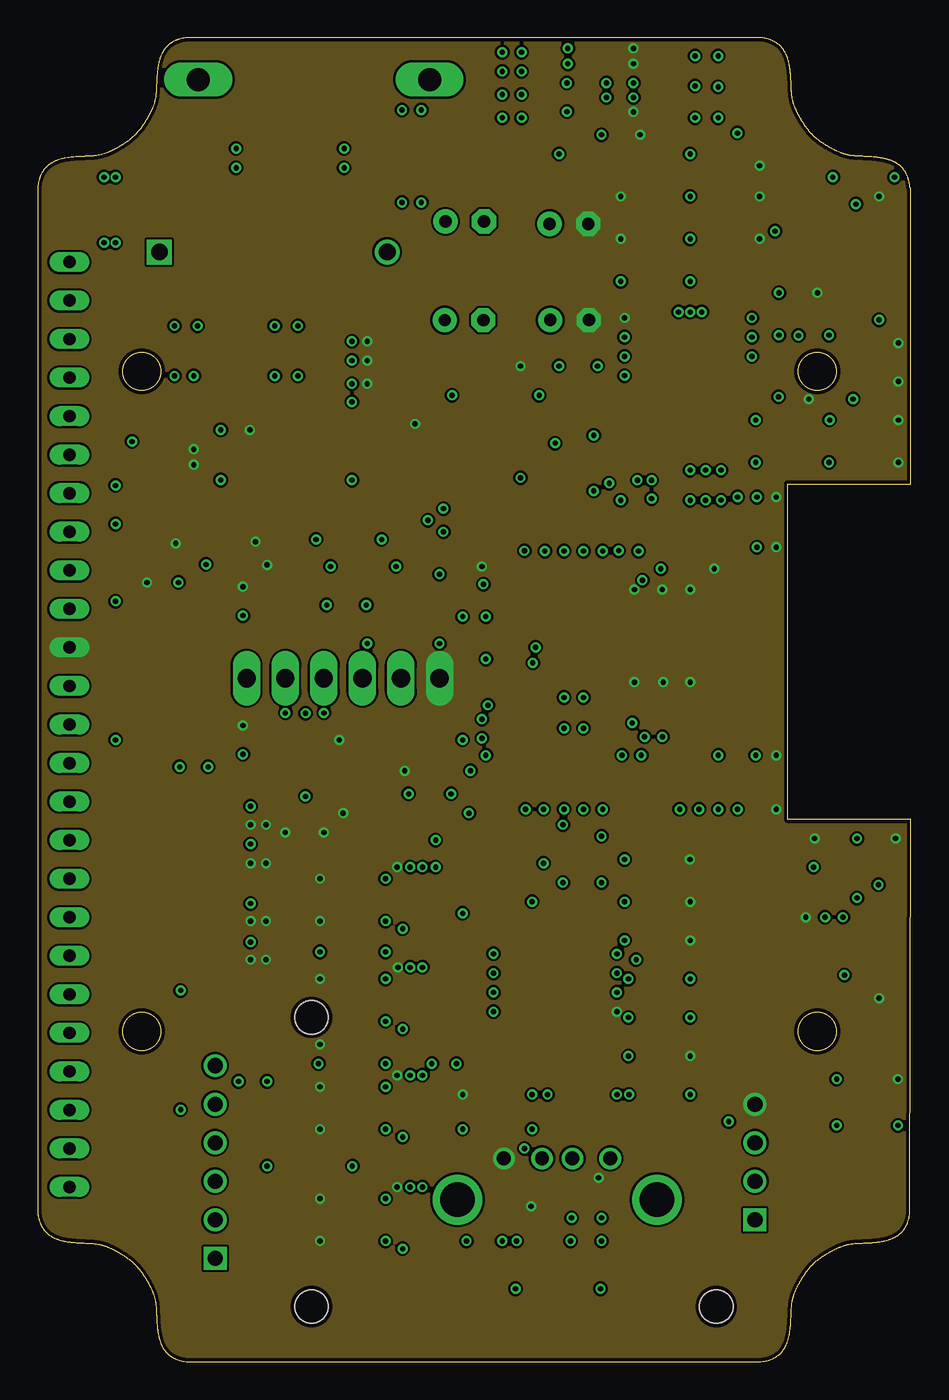
[diagram p7: board, inner layer Route2]
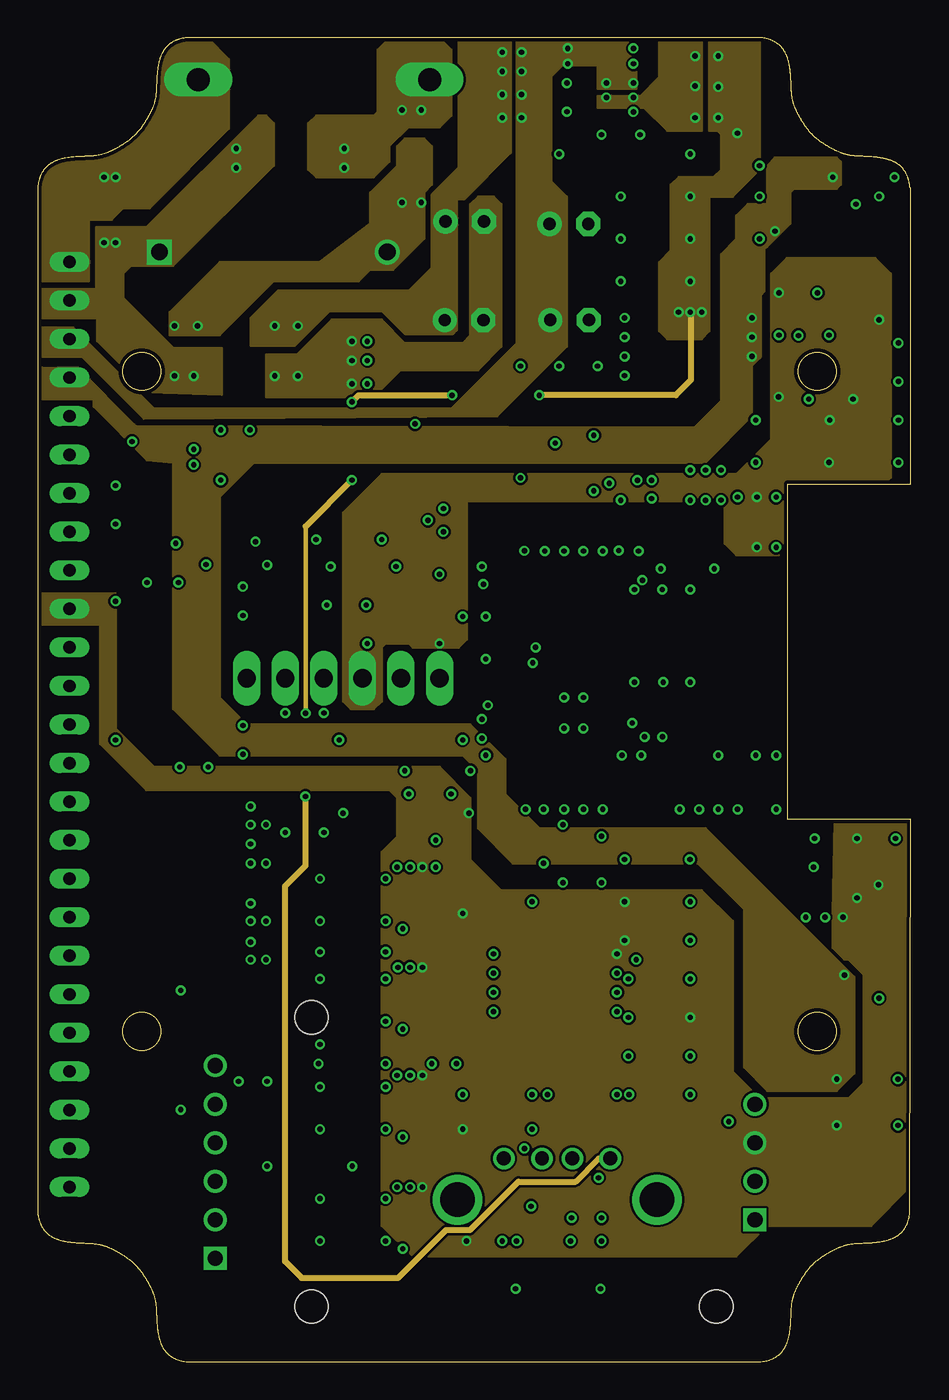
[diagram p8: board, inner layer Route15]
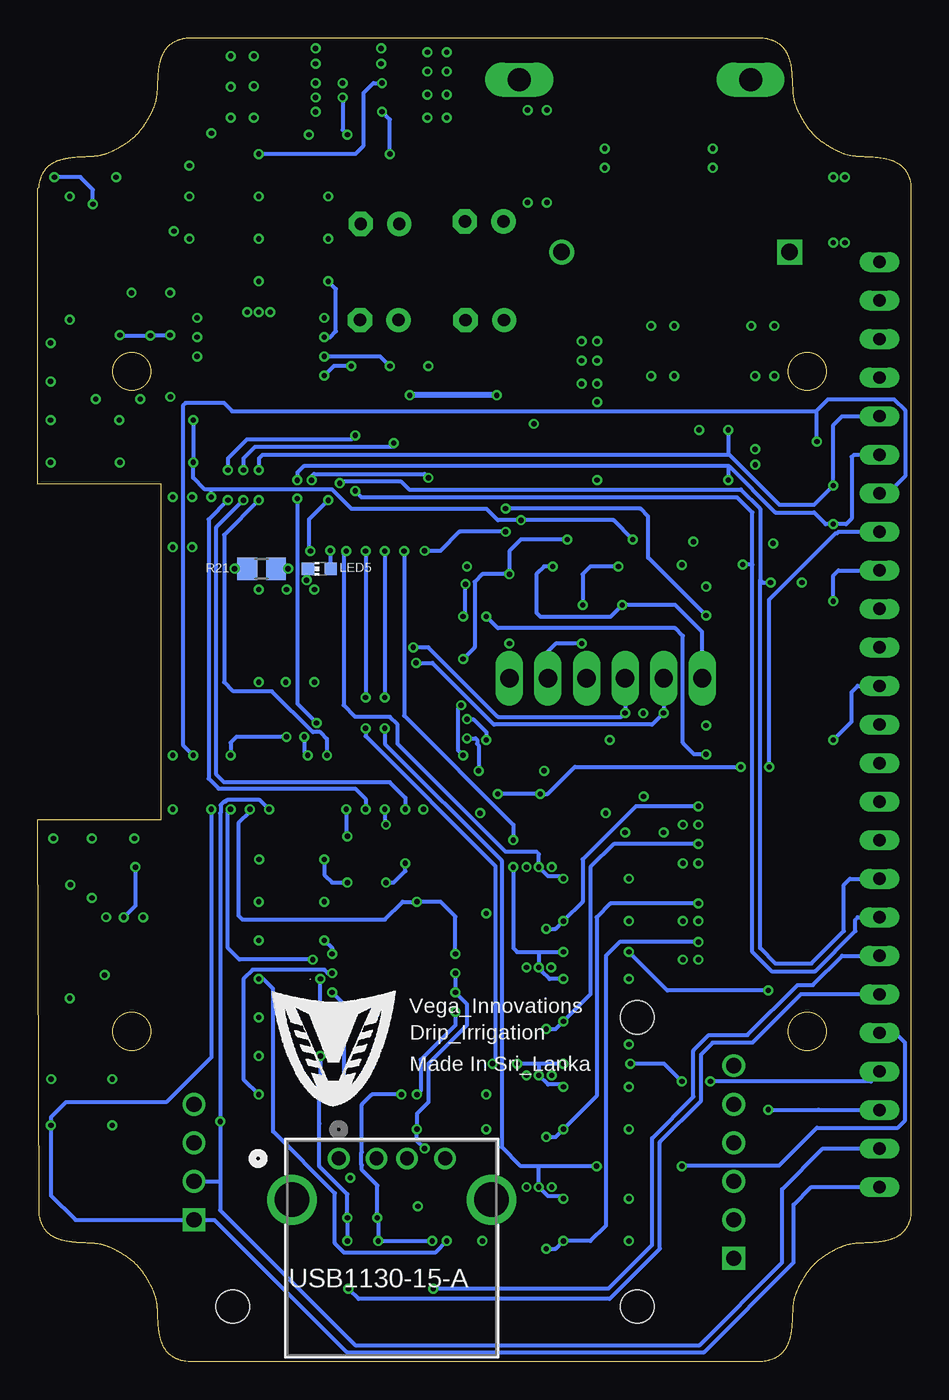
[diagram p9: board, bottom side, seen from below]

Size 57.51 x 87.22 mm. Coordinates in mm from the lower left corner, seen from the top.
Outline: 1193 segments
Outline: circle at 51.33,65.26 radius 1.25
Outline: circle at 6.83,65.26 radius 1.25
Outline: circle at 6.83,21.76 radius 1.25
Outline: circle at 51.33,21.76 radius 1.25
Copper layers (1*2+15*16): Top 0.035mm / dielectric 1.5mm / Route2 0.035mm / dielectric 0.15mm / Route15 0.035mm / dielectric 0.2mm / Bottom 0.035mm
Design rules "Aptinex Fusion_eagle_rule_4_layer_0.3mm_dril,6mil_trace *": minimum track width 6mil, minimum drill 0.3mm, track to track 6mil, track to pad 6mil, pad to pad 6mil, via to via 6mil, smd to smd 0mil, copper to edge 10mil, drill to drill 10mil, minimum pad ring 10mil, minimum via ring 6mil, stop-mask expansion 2mil, vias tented up to drill 100mil, thermal gap 10mil

### Footprints (pad centres in the part's own frame; a part is rotated, then mirrored left to right if it is on the bottom)
C0805 = smd 1.3 x 1.5: 1 -0.95,0; 2 0.95,0
E2,5-5 = drill 0.813 pad 1.6: + -1.27,0 | drill 0.813 pad 1.6 octagon: - 1.27,0
CAP_B32912A--15--7X12.5X18_TDK = drill 1.092 pad 1.6 square: 1 0,0 | drill 1.092 pad 1.6: 2 15.011,0
SMB_STM-L = smd 1.905 x 2.21: 1 -1.994,0; 2 1.994,0
DO201-15 = drill 1.499 long: A 7.62,0; C -7.62,0
SOT23 = smd 1 x 1.4: 1 -0.95,-1.1; 2 0.95,-1.1; 3 0,1.1
ESP32WROOM32EM113EH6400PH3Q0 = smd 2 x 0.9: 1 -8.5,5.51; 2 -8.5,4.24; 3 -8.5,2.97; 4 -8.5,1.7; 5 -8.5,0.43; 6 -8.5,-0.84; 7 -8.5,-2.11; 8 -8.5,-3.38; 9 -8.5,-4.65; 10 -8.5,-5.92; 11 -8.5,-7.19; 12 -8.5,-8.46; 13 -8.5,-9.73; 14 -8.5,-11; 25 8.5,-11; 26 8.5,-9.73; 27 8.5,-8.46; 28 8.5,-7.19; 29 8.5,-5.92; 30 8.5,-4.65; 31 8.5,-3.38; 32 8.5,-2.11; 33 8.5,-0.84; 34 8.5,0.43; 35 8.5,1.7; 36 8.5,2.97; 37 8.5,4.24; 38 8.5,5.51 | smd 0.9 x 2: 15 -5.715,-12; 16 -4.445,-12; 17 -3.175,-12; 18 -1.905,-12; 19 -0.635,-12; 20 0.635,-12; 21 1.905,-12; 22 3.175,-12; 23 4.445,-12; 24 5.715,-12 | smd 1.33 x 1.33: 39 -1,-1.99; 40 -1,-3.825; 41 0.835,-3.825; 42 0.835,-1.99; 43 0.835,-0.155; 44 -1,-0.155; 45 -2.835,-0.155; 46 -2.835,-1.99; 47 -2.835,-3.825
SOT65P210X110-6N = smd 1 x 0.4: 1 -1,0.65; 2 -1,0; 3 -1,-0.65; 4 1,-0.65; 5 1,0; 6 1,0.65
CONN4_USB1130-15-A_GCT = drill 0.914 pad 1.422: 1 0,0; 2 2.489,0; 3 4.496,0; 4 7.01,0 | drill 2.261 pad 2.769: 5 -3.073,-2.718; 6 10.058,-2.718
JBK20L = drill 0.813 long: 1 24.13,0; 2 21.59,0; 3 19.05,0; 4 16.51,0; 5 13.97,0; 6 11.43,0; 7 8.89,0; 8 6.35,0; 9 3.81,0; 10 1.27,0; 11 -1.27,0; 12 -3.81,0; 13 -6.35,0; 14 -8.89,0; 15 -11.43,0; 16 -13.97,0; 17 -16.51,0; 18 -19.05,0; 19 -21.59,0; 20 -24.13,0; 21 -26.67,0; 22 -29.21,0; 23 -31.75,0; 24 -34.29,0; 25 -36.83,0
VLS6045 = smd 1.9 x 5.1: 1 -2.1,0; 2 2.1,0
IND_ACM7060_TDK = smd 2.489 x 1.499: 1 -3.251,1.5; 2 -3.251,-1.5; 3 3.251,-1.5; 4 3.251,1.5
IND_BOURNS_MH2029 = smd 1.016 x 1.016: 1 -1.016,0; 2 1.016,0
CHIP-LED0603 = smd 0.8 x 0.8: A 0,-0.75; C 0,0.75
TSOT26_DIO = smd 0.902 x 0.508: 1 -1.302,0.95; 2 -1.302,0; 3 -1.302,-0.95; 4 1.302,-0.95; 5 1.302,0; 6 1.302,0.95
SOT95P230X110-3N = smd 1.26 x 0.59: 1 -0.98,0.95; 2 -0.98,-0.95; 3 0.98,0
BUK9K12-60E = smd 0.7 x 1.15: 1 -1.905,-3.026; 2 -0.635,-3.026; 3 0.635,-3.026; 4 1.905,-3.026 | smd 0.7 x 1.2: 5 1.905,2.849; 6 0.635,2.849; 7 -0.635,2.849; 8 -1.905,2.849 | smd 1.97 x 4.1: 9 1.27,0.199; 10 -1.27,0.199
R0805 = smd 1.3 x 1.5: 1 -0.95,0; 2 0.95,0
CT/CN0805 = smd 1.2 x 1.4: 1 -1.1,0; 2 1.1,0
R1206 = smd 1.6 x 1.803: 1 -1.422,0; 2 1.422,0
TACTILE_SWITCH_SMD_6.2MM_TALL = smd 1.55 x 1.3: A1 -3.975,-2.25; A2 3.975,-2.25; B1 -3.975,2.25; B2 3.975,2.25
SOIC127P600X170-9N = smd 1.525 x 0.65: 1 -2.712,1.905; 2 -2.712,0.635; 3 -2.712,-0.635; 4 -2.712,-1.905; 5 2.712,-1.905; 6 2.712,-0.635; 7 2.712,0.635; 8 2.712,1.905 | smd 2.85 x 3.2: 9 0,0
SOIC127P600X175-8N = smd 1.981 x 0.559: 1 -2.464,1.905; 2 -2.464,0.635; 3 -2.464,-0.635; 4 -2.464,-1.905; 5 2.464,-1.905; 6 2.464,-0.635; 7 2.464,0.635; 8 2.464,1.905
AP7361EA = smd 0.802 x 1.505: 1 0,0; 2 1.27,0; 3 2.54,0; 4 3.81,0; 5 3.81,6.5; 6 2.54,6.5; 7 1.27,6.5; 8 0,6.5
DDTD113ZC-7-F = smd 0.8 x 0.9: 1 -0.95,-2; 2 0.95,-2; 3 0,0
RTC-DS3231-AT24C32 = drill 1 square: J1.1 17.78,6.35; J2.1 -17.78,3.81 | drill 1: J1.2 17.78,3.81; J1.3 17.78,1.27; J1.4 17.78,-1.27; J1.5 17.78,-3.81; J1.6 17.78,-6.35; J2.2 -17.78,1.27; J2.3 -17.78,-1.27; J2.4 -17.78,-3.81 | hole 2.2: 11.43,-9.525; 11.43,9.525; -15.24,9.525
6POL254 = drill 1.2 pad 1.778 long: 1 -6.35,0; 2 -3.81,0; 3 -1.27,0; 4 1.27,0; 5 3.81,0; 6 6.35,0

### Placement (x,y rotation side)
C1  40.93,30.3 180 top
C2  49.82,62.05 0 top
C3  40.93,27.76 180 top
C4  35.02,68.63 0 top
C5  54.65,62.05 0 top
C9  8.16,57.73 0 top
C11  54.65,59.25 180 top
C14  37.07,85.96 0 top
C15  36.37,79.53 180 top
C16  45.25,76.78 0 top
C17  40.68,76.78 180 top
C18  55.37,33.52 90 top
C19  54.65,18.61 0 top
C20  40.68,73.98 180 top
C21  45.25,73.98 0 top
C22  8,73.11 0 top
C23  28.12,75.13 0 top
C24  28.07,68.63 0 top
C25  34.98,74.98 0 top
C69  8.16,55.19 0 top
C76  54.65,64.59 0 top
C77  50.08,78.05 180 top
CR1  16.76,79.32 180 top
D1  18.18,84.47 180 top
D2  36.11,10.23 0 top
IC2  43.12,46.78 270 top
IC3  24.68,9.47 270 top
IC4  24.68,16.83 270 top
IC5  24.68,30.55 270 top
IC6  24.68,23.95 270 top
J1  37.7,13.38 0 bottom
J2  2.07,48.33 90 top
L1  44.08,84.05 0 top
L2  13.08,65.06 0 top
L3  31.32,84.05 0 top
L4  21.31,65.03 0 top
L5  34.58,33.34 90 top
LED1  37.12,33.09 180 top
LED2  55.41,70.43 0 top
LED3  31.79,60.01 0 top
LED4  26.45,40.96 90 top
LED5  38.97,52.25 90 bottom
LED7  16.29,40.96 180 top
LED8  18.83,40.96 180 top
LED9  55.41,29.79 180 top
MOSFET1  36.96,83.3 180 top
Q1  18.32,52.14 90 top
Q2  22.64,52.14 90 top
Q3  9.94,34.69 90 top
Q5  9.94,28.28 90 top
R1  40.93,33.09 180 top
R2  55.41,73.48 270 top
R3  40.68,79.57 0 top
R4  18.07,48.58 180 top
R5  22.14,40.96 0 top
R6  31.79,63.32 270 top
R7  36.11,6.42 180 top
R8  30.26,30.3 0 top
R9  35.85,17.6 0 top
R10  18.83,37.15 90 top
R11  26.45,36.14 0 top
R12  54.65,15.56 0 top
R13  49.82,59.25 180 top
R14  16.29,37.15 90 top
R15  50.33,15.56 180 top
R16  55.41,26.23 90 top
R17  40.93,17.6 0 top
R18  26.45,49.6 90 top
R19  26.45,38.93 0 top
R20  30.26,17.6 0 top
R21  42.78,52.25 0 bottom
R22  22.64,48.58 0 top
R23  7.91,40.96 180 top
R24  4.77,75.86 270 top
R25  45.19,79.6 0 top
R26  50.33,18.61 180 top
R27  52.61,33.48 270 top
R28  49.78,33.52 90 top
R29  24.55,79.54 270 top
R30  40.68,71.19 180 top
R31  34.33,63.32 90 top
R32  36.87,63.32 90 top
R33  8.16,50.11 180 top
R35  30.26,15.31 0 top
R36  40.93,22.68 0 top
R37  40.93,25.22 180 top
R38  40.93,20.14 0 top
R39  30.52,6.42 0 top
R40  12.98,55.14 180 top
R41  21.12,10.74 0 top
R42  13.01,60.07 0 top
R43  54.39,78.05 0 top
R44  48.79,65.62 90 top
R45  30.26,33.09 0 top
R46  21.12,18.1 0 top
R47  21.12,31.82 0 top
R48  54.65,67.13 0 top
R49  21.12,25.22 0 top
R50  21.12,15.31 0 top
R51  21.12,7.94 0 top
R52  21.12,29.03 0 top
R53  21.12,22.42 0 top
R54  8.21,60.07 0 top
R55  13.01,52.55 180 top
R56  8.13,52.58 180 top
R66  22.39,36.14 180 top
S1  20.36,57.73 0 top
S3  42.96,66.87 0 top
U2  34.07,24.96 0 top
U$1  53.12,30.55 180 top
U$2  10.71,50.11 90 top
U$3  29.45,13.15 180 top
U$4  31.53,10.23 0 top
U$8  10.71,40.96 90 top
U$12  48.82,69.26 0 top
X1  20.1,45.03 0 top

### Tracks (layer width: path | path; a pad name or v marks a point on that pad's centre or on a via)
485_N  (via drill 0.35)
  Top 0.254: v37.12,9.47 37.05,9.4 D2.2 | v37.12,7.94 37.05,7.88 R7.1 v37.05,4.8 | R17.1 v38.94,17.6 | R38.1 v38.9,20.14
  Bottom 0.254: v37.12,7.94 v37.12,9.47 37.12,11.03 38.97,12.88 38.97,15.67 38.97,17.57 v38.94,17.6 38.9,17.64 v38.9,20.14 | v37.05,4.8 36.39,4.13 19.85,4.13 16.55,7.44 16.55,14.47 13.82,17.19 13.82,20.24 13.06,21 10.45,21 7.26,24.2 J2.20
485_P  (via drill 0.35)
  Top 0.254: D2.1 v35.16,9.47 | R9.1 v33.56,17.6 | v31.53,7.94 31.47,7.88 R39.2 v31.47,4.8 | v35.09,7.94 35.16,7.88 R7.2
  Bottom 0.254: v31.53,7.94 v35.09,7.94 35.09,9.47 v35.16,9.47 35.16,11.6 36.17,12.62 36.17,12.95 36.2,12.97 36.2,13.79 36.17,13.82 36.17,16.94 35.52,17.6 v33.56,17.6 | v31.47,4.8 19.95,4.8 17.05,7.69 17.05,14.72 14.33,17.45 14.33,20.5 13.31,21.51 10.77,21.51 7.47,24.81 6.46,24.81 4.53,26.74 J2.19
+3V3A  (via drill 0.35)
  Top 0.254: R12.1 v52.62,15.56 R15.1 | C1.2 v38.65,30.3 | C3.2 v38.65,27.76 | R36.2 v42.96,22.68 | R8.1 28.74,30.3 v27.98,29.53 | IC5.1 v25.33,32.58 | IC6.1 v25.33,25.98 | IC4.1 v25.33,18.87 | IC3.1 v25.33,11.5 | R35.1 v27.98,15.31 | v28.23,7.94 29.57,6.61 R39.1 | U2.8 v38.14,26.87 | R11.2 v28.39,36.14 | R27.1 53.92,34.43 v53.95,34.47 | C18.1 v55.37,31.42 55.37,30.58 LED9.A | v53.02,29.28 53.02,30.45 U$1.1 v53.95,30.55
  Bottom 0.254: v38.65,27.76 38.14,27.25 v38.14,26.87
  pour Route15 (no thermals): 52.36,27.25 52.36,29.53 52.47,35.63 57.44,35.63 57.44,11.5 54.9,8.96 48.04,8.96 46.01,6.93 24.68,6.93 22.64,8.96 22.64,33.6 23.66,34.61 23.66,37.15 23.15,37.66 7.15,37.66 4.1,40.71 4.1,48.58 0.04,48.58 0.04,50.62 5.12,50.62 5.12,41.73 7.66,39.19 26.45,39.19 28.49,37.15 28.49,33.09 30.52,31.06 43.73,31.06 45.76,29.03 45.76,19.12 47.54,17.34 53.38,17.34 54.39,18.36 54.39,25.47 53.38,26.49 53.12,26.49
+3V3C  (via drill 0.35)
  Top 0.254: U$12.1 48.82,70.41 v48.8,70.43 | C5.1 v52.16,62.05 | C11.2 v52.11,59.25 R13.1 | LED2.A v55.41,68.65 | R44.1 v48.79,63.57 | v47.36,56.97 IC2.2 v47.36,53.66 | R18.1 v26.45,47.31 | C76.1 v53.7,63.42
  pour Route15 (no thermals): 48.3,71.7 49.31,72.71 55.16,72.71 56.17,71.7 56.17,58.24 55.66,57.73 49.82,57.73 49.82,54.17 48.8,53.16 46.01,53.16 45.25,53.92 45.25,56.71 28.23,56.71 28.23,47.57 27.72,47.06 24.68,47.06 24.42,47.31 22.9,47.31 22.64,47.06 22.64,43.5 22.14,43 20.61,43 20.1,43.5 20.1,55.95 22.64,58.49 46.01,58.49 48.3,60.78
+5V  (via drill 0.35)
  Top 0.254: R25.2 46.14,80.88 v46.08,80.95 | C16.1 v42.96,76.78 C17.1 | C21.1 v42.96,73.98 C20.1 | S3.9 42.2,67.63 v42.2,69.16 | v42.96,69.16 S3.9 | S3.9 43.73,67.63 v43.73,69.16 | R30.1 v42.96,71.19 | L1.2 45.83,84.4 45.83,86.03 v44.81,86.03 | L1.2 44.86,84.05 v44.81,84 | L1.2 46.18,82.57 45.57,81.96 v44.81,81.96 | 17.62,42.7 v17.63,42.72
  Top 0.406: v17.62,37.24 17.62,42.7 | v20.68,58.09 v20.68,63.24
  Route15 0.254: 43.03,69.09 v42.96,69.16
  Route15 0.305: v17.63,42.72 17.63,44.53 17.63,55.04
  Route15 0.406: v17.62,37.24 17.63,37.23 17.63,32.69 16.28,31.34 16.28,6.6 17.38,5.51 23.73,5.51 26.89,8.67 28.46,8.67 31.65,11.86 35.41,11.86 36.94,13.38 J1.1 | 17.63,55.04 v20.68,58.09 | v20.68,63.24 21.12,63.68 v27.28,63.68 | 43.03,69.09 43.03,64.69 42.02,63.68 v33.02,63.68
  Bottom 0.406: v27.28,63.68 v33.02,63.68
  pour Route15: 47.03,87.7 44.23,87.7 44.23,81.1 44.74,81.1 45,80.84 45,78.56 44.49,78.05 42.2,78.05 41.69,77.54 41.69,73.22 40.93,72.46 40.93,67.89 41.44,67.38 43.73,67.38 44.23,67.89 44.23,76.78 45.76,76.78 47.54,78.56 47.54,87.19
+5VA  (via drill 0.35)
  Top 0.254: C19.1 v52.62,18.61 R26.1 | U$1.8 v53.12,25.47 | v47.03,68.78 S3.8 | v47.03,67.51 S3.7 | v47.03,66.24 S3.6 | C77.1 v52.36,78.05 R43.1 | U$12.8 48.82,74.76 v48.55,74.49
  pour Route15 (no thermals): 48.04,78.81 48.55,79.32 52.62,79.32 52.87,79.06 52.87,77.54 52.62,77.29 49.82,77.29 49.57,77.03 49.57,75 48.04,73.48 47.86,73.33 47.86,70.53 47.6,70.28 47.6,66.22 47.54,66.11 47.03,65.6 47.03,62.3 43.98,59.25 14.26,59.25 11.97,56.97 11.97,43.76 13.75,41.98 28.49,41.98 30.77,39.69 30.77,37.41 33.06,35.12 43.98,35.12 53.76,25.34 53.76,18.99 52.62,17.85 48.04,17.85 46.52,19.37 46.52,29.79 43.47,32.84 31.28,32.84 28.99,35.12 28.99,38.93 27.98,39.95 11.97,39.95 8.93,43 8.93,59.25 7.17,59.41 3.66,62.91 3.66,63.42 0.1,63.42 0.1,65.71 0.36,65.45 2.65,65.45 6.35,61.75 6.35,61.54 6.46,61.64 43.22,61.54 45,63.32 45,72.97 46.01,73.98 46.01,75.51 46.77,76.27 48.04,76.27
+12V  (via drill 0.35)
  Top 0.254: L3.2 32.8,83.44 31.91,83.44 v31.86,83.49 | L3.2 32.87,84.59 32.87,86.28 v31.86,86.28 | L3.2 32.45,85.01 v31.86,85.01 | L3.2 33.41,82.76 32.62,81.96 v31.86,81.96 | v34.9,86.54 35.54,86.54 C14.1 35.68,85.52 v34.9,85.52 | v39.22,84.25 MOSFET1.3 v37.44,84.25
  pour Route15 (no thermals): 31.53,87.19 38.65,87.19 39.41,86.43 39.41,83.89 36.87,83.89 36.87,85.41 34.58,85.41 33.82,84.65 33.82,77.79 34.84,76.78 34.84,66.87 30.26,62.3 6.96,62.15 2.9,66.22 -0.15,66.22 -0.22,68.14 2.32,68.14 7.66,62.81 27.21,62.81 31.53,67.13
BUTTON1  (via drill 0.35)
  Top 0.254: v37.63,57.88 37.63,58.49 38.39,59.25 40.42,59.25 41.54,58.14 41.54,55.81 IC2.7 | R56.1 9.25,52.41 v9.25,51.34
  Bottom 0.254: 9.94,51.48 9.94,27.25 8.93,26.23 6.56,26.23 4.42,28.37 4.42,31.42 4.02,31.82 J2.17 | 9.94,51.48 9.94,56.2 11.21,57.47 33.06,57.47 33.56,57.98 37.53,57.98 v37.63,57.88 | 9.94,51.48 9.8,51.34 v9.25,51.34
BUTTON2  (via drill 0.35)
  Top 0.254: v38.39,56.76 38.34,56.81 37.18,56.81 v36.62,57.37 v36.61,57.37 | v39.56,53.41 42.2,53.41 42.28,53.49 IC2.6 | R55.2 11.1,52.55 v11.08,52.52
  Bottom 0.254: 10.45,52.5 10.45,26.99 9.18,25.72 6.31,25.72 3.66,28.37 3.66,29.13 3.51,29.28 J2.18 | 10.45,52.5 10.45,55.95 11.47,56.97 36.2,56.97 v36.61,57.37 | v38.39,56.76 39.66,55.49 39.66,53.51 v39.56,53.41 | 10.45,52.5 10.48,52.52 v11.08,52.52
BUZZER_OUT
  pour Top (no thermals): -0.47,42.85 2.65,42.85 7.47,37.01 11.79,37.01 11.79,34.97 7.47,34.97 4.17,38.28 4.17,39.55 2.9,40.82 -0.47,40.82
BUZZER_SIGNAL_OUT  (via drill 0.35)
  Top 0.254: IC5.2 24.68,32.42 v24.52,32.58 | R47.2 v22.9,31.82 | IC2.10 v37.2,53.41
  Bottom 0.254: v37.2,53.41 37.38,53.23 37.38,43.25 36.61,42.49 34.33,42.49 33.82,41.98 33.82,40.71 26.71,33.6 24.68,33.6 24.52,33.44 v24.52,32.58 23.91,31.97 23.05,31.97 v22.9,31.82
DTR  (via drill 0.35)
  Top 0.254: R4.1 v19.02,49.85 | Q2.2 v23.59,52.39
  Bottom 0.254: X1.1 13.75,48.08 15.53,49.85 v19.02,49.85 19.78,49.09 24.42,49.09 24.68,49.35 24.68,51.89 24.17,52.39 v23.59,52.39
EMPTY_PIN1  (via drill 0.35)
  Top 0.254: C9.1 v5.12,57.73 | IC2.30 v38.47,39.95 | v42.96,58.74 v42.96,56.76 | v12.04,61.39 12.04,60.08 R42.1
  Bottom 0.254: 12.04,59.76 42.71,59.76 42.96,59.51 v42.96,58.74 | 12.04,59.76 11.97,59.76 8.67,56.46 6.39,56.46 v5.12,57.73 5.12,61.71 4.53,62.3 J2.5 | v42.96,56.76 45.25,54.48 45.25,44.77 44.64,44.17 42.1,44.17 39.41,41.47 38.9,41.47 38.47,41.04 v38.47,39.95 | v12.04,61.39 12.04,59.76
EN  (via drill 0.35)
  Top 0.254: S1.A2 25.66,55.48 v25.69,55.44 | C2.1 v47.28,62.05 | R13.2 v47.28,59.25 | IC2.3 v46.09,56.97 | Q1.3 v18.32,54.17
  Bottom 0.254: v18.32,54.17 19.59,55.44 v25.69,55.44 27.21,55.44 27.98,56.2 36.87,56.2 38.14,57.47 46.01,57.47 | v47.28,62.05 v47.28,59.25 47.28,58.24 46.52,57.47 46.01,57.47 | v46.09,56.97 46.09,57.4 46.01,57.47
FAC_RESET1  (via drill 0.35)
  Top 0.254: v47.28,39.95 47.36,39.87 IC2.37 | R54.1 6.76,60.07 v6.2,60.63
  Bottom 0.254: v47.28,39.95 47.97,40.63 47.97,62.98 47.79,63.16 45.25,63.16 44.72,62.63 6.23,62.63 | 6.23,62.63 5.44,63.42 1.12,63.42 0.38,62.68 0.38,58.34 1.5,57.22 J2.7 | 6.23,62.63 6.23,60.66 v6.2,60.63
FERTILIZER_PUMP_OUT
  pour Top (no thermals): -0.47,37.51 2.65,37.51 5.44,34.72 5.44,30.91 6.46,30.91 9.1,30.8 10.71,30.8 10.96,30.55 10.96,28.52 10.12,28.52 4.93,28.62 4.93,33.7 2.9,35.74 -0.47,35.74
FERTILIZER_PUMP_SIGNAL_OUT  (via drill 0.35)
  Top 0.254: IC4.2 24.68,18.71 v24.52,18.87 | R46.2 v22.9,18.1 | IC2.11 v35.93,53.41 | v35.93,43.76 v35.93,41.73 | v27.57,19.63 v25.95,19.63 | v22.9,19.63 v18.48,19.63 | v13.21,18.46 v15.09,18.46
  Bottom 0.254: v35.93,53.41 v35.93,43.76 | v35.93,41.73 35.93,41.22 27.37,32.66 27.37,19.83 v27.57,19.63 | v22.9,19.63 24.49,19.63 | 24.49,19.63 v25.95,19.63 | J2.22 2.07,19.04 2.65,18.46 v13.21,18.46 | v15.09,18.46 16.25,19.63 v18.48,19.63 | v22.9,18.1 23.05,18.26 23.91,18.26 v24.52,18.87 24.49,18.89 24.49,19.63
FILLED_PIN1  (via drill 0.35)
  Top 0.254: C69.1 v5.12,55.19 | IC2.31 v39.74,39.95 | v40.42,58.08 v40.42,56.87 | v39.15,42.08 39.96,41.27 v39.96,41.17 | v12.04,58.09 12.04,55.15 R40.2
  Bottom 0.254: v40.42,58.08 40.42,58.59 40.01,59 12.04,59 | 12.04,59 11.97,59 8.93,55.95 6.39,55.95 5.62,55.19 v5.12,55.19 4.28,55.19 3.92,55.55 3.92,59.61 3.77,59.76 J2.6 | v39.96,41.17 39.96,40.17 v39.74,39.95 | v39.15,42.08 40.42,43.35 v40.42,56.87 | 12.04,59 v12.04,58.09
FLOW  (via drill 0.35)
  Top 0.254: L5.2 v34.58,35.38 | IC2.27 v34.66,36.39
  Bottom 0.254: v34.66,36.39 34.66,35.45 v34.58,35.38
FLOW_SENSOR_IN1  (via drill 0.35)
  Top 0.254: R66.1 24.42,36.14 | R11.1 24.42,36.14 | v27.21,37.41 28.49,37.41 29.31,36.58 R45.1 | v9.34,39.19 v11.21,39.19 | 24.42,36.14 v24.42,37.41
  Bottom 0.254: v9.34,39.19 9.34,50.21 4.96,54.58 4.87,54.58 4.77,54.68 J2.8 | v27.21,37.41 v24.42,37.41 23.91,37.41 22.14,39.19 v11.21,39.19
GND  (via drill 0.35)
  Top 0.254: C20.2 v38.39,73.98 | C17.2 v38.39,76.78 | C16.2 v47.54,76.78 | C21.2 v47.54,73.98 | R3.1 39.73,80.78 v39.66,80.84 | U$12.3 51.36,70.41 v51.34,70.43 | v56.68,67.13 R48.2 | v56.68,64.59 C76.2 | v56.68,62.05 C5.2 | v56.68,59.25 C11.1 | R6.1 v31.79,65.6 | v55.41,76.78 R2.1 | v48.63,56.97 IC2.1 v48.63,53.66 | R16.1 v55.41,23.95 | C19.2 | C19.2 v56.65,18.61 | U$1.3 v50.58,29.28 | R49.1 v18.58,25.22 | R53.1 18.64,20.9 v18.58,20.9 | R46.1 v18.58,18.1 | R50.1 v18.58,15.31 | R41.1 v18.58,10.74 | R51.1 v18.58,7.94 | R20.1 v27.98,17.6 | R38.2 v42.96,20.14 | R52.1 v18.58,29.03 | R47.1 v18.58,31.82 | Q5.1 13.08,26.49 v14.01,26.49 | Q5.3 13.08,29.03 v14.01,29.03 | Q3.1 13.02,32.84 v14.01,32.84 | v14.01,35.38 13.02,35.38 Q3.3 | IC5.3 24.03,32.22 v23.66,32.58 | IC6.3 24.03,25.61 23.91,25.73 23.91,25.78 v23.71,25.98 | IC4.3 24.03,18.5 v23.66,18.87 | IC3.3 24.03,11.13 v23.66,11.5 | U$4.2 v32.48,10.23 | C3.1 v42.96,27.76 | v42.96,30.3 C1.1 | U2.5 v38.14,23.06 | R5.1 v19.85,40.96 | R66.2 v20.1,36.14 | R10.1 v18.83,34.87 | R14.1 v16.29,34.87 | R19.1 v24.17,38.93 | U$2.2 v13.5,51.06 | U$8.2 v13.5,41.91 | v48.63,36.39 IC2.38 v48.63,39.95 | C69.2 9.08,55.15 v9.08,53.92 | IC2.15 31.02,52.39 v29.25,52.39 | v24.84,61.79 24.33,61.28 S1.B2 | v10.26,59.1 10.26,58.11 9.88,57.73 C9.2 | IC2.40 IC2.41 v39.29,44.77 | IC2.45 IC2.46 v41.13,50.87 | IC2.45 IC2.44 | IC2.44 IC2.39 IC2.42 41.19,45.89 v41.19,44.77 | IC2.44 IC2.43 v42.96,44.77 | IC2.45 v42.96,50.87 | R1.1 v42.94,33.09 | C77.2 48.3,78.05 v47.54,78.81 | S3.1 v38.65,68.78 | IC2.47 v39.29,50.87 | 23.41,65.96 L4.2 22.82,64.44 v21.7,64.44 | 23.41,65.96 23.41,67.04 23.22,67.23 v21.7,67.23 | C18.2 v56.49,34.47 | R28.2 v51.16,34.47 | MOSFET1.1 v39.22,82.35
  Top 0.254: v39.22,86.54 38.59,86.54 C14.2 38.46,85.52 v39.22,85.52 | C2.2 v50.77,63.42 | v21.7,65.96 23.41,65.96 | D2.3 36.89,12.11 v36.94,12.11 | R54.2 9.21,60.12 v10.27,60.12 | v13.96,61.39 R42.2 | R40.1 14.33,54.74 v14.33,54.02 | R55.1 14.01,52.5 v15.09,52.5 | R56.2 v7.18,51.34
  Bottom 0.254: R21.1 v44.55,52.25
  other vias: 15.02,29.03 15.02,32.84 15.02,35.38 15.02,26.49
  pour Route2 (no thermals): -5.8,92.27 -5.8,-2.72 -4.54,-3.99 61.25,-3.99 63.79,-1.45 63.79,91.26 61.51,93.54 -4.54,93.54
  pour Top (no thermals): 15.28,34.87 12.23,34.87 12.23,35.88 15.28,35.88
  pour Top (no thermals): 12.23,32.33 15.28,32.33 15.28,33.34 12.23,33.34
  pour Top (no thermals): 12.23,28.52 15.28,28.52 15.28,29.53 12.23,29.53
  pour Top (no thermals): 12.23,25.98 15.28,25.98 15.28,26.99 12.23,26.99
GND_SUPPLY  (via drill 0.35)
  Top 0.254: v4.36,73.73 4.36,74.35 R24.2 5.12,74.41 v5.12,73.73 | v8.99,64.95 8.99,63.68 9.71,63.68 L2.2 10.27,63.99 v10.27,64.95 | v13.06,79.93 14.15,79.93 CR1.2 14.12,78.66 v13.06,78.66
  pour Route15 (no thermals): 14.51,82.11 15.02,82.11 15.53,81.6 15.53,78.81 8.93,72.21 6.13,72.21 5.62,71.7 5.62,70.09 8.94,66.77 12.09,66.77 12.09,63.73 7.26,63.89 3.92,67.23 3.92,68.76 -0.15,68.76 -0.22,68.82 -0.22,70.68 3.85,70.68 3.85,74.75 7.15,74.75
GPIO0  (via drill 0.35)
  Top 0.254: R18.2 v26.45,51.89 | Q2.3 v22.64,54.17 | IC2.25 v32.12,36.39 30.77,36.39 29.5,37.66 v29.5,39.95 | v29.5,46.3 29.5,43.39 v29.64,43.25
  Bottom 0.254: v22.64,54.17 25.69,54.17 26.45,53.41 v26.45,51.89 28.23,51.89 28.74,51.38 28.74,47.06 v29.5,46.3 | v29.64,43.25 29.85,43.03 29.85,40.3 v29.5,39.95
LED1  (via drill 0.35)
  Top 0.254: v37.12,34.61 LED1.A | IC2.29 v37.2,36.39
  Bottom 0.254: v37.2,36.39 37.2,34.69 v37.12,34.61
LED2  (via drill 0.35)
  Top 0.254: LED3.A v31.79,58.24 | v39.48,58.08 39.48,55.54 IC2.8
  Bottom 0.254: v31.79,58.24 32.04,58.49 39.33,58.49 39.48,58.33 v39.48,58.08
LED2_IN  (via drill 0.35)
  Top 0.254: IC2.14 32.04,55.2 v32.04,53.43 | U$2.1 v13.5,49.16 | v26.71,56.2 v26.71,54.68
  Bottom 0.254: v13.5,49.16 17.31,52.97 17.31,55.7 17.82,56.2 v26.71,56.2 | v26.71,54.68 29.76,54.68 31.01,53.43 v32.04,53.43
LED2_OUT  (via drill 0.35)
  Top 0.254: R33.2 v5.12,50.11
  Bottom 0.254: J2.9 2.14,52.14 3.08,52.14 4.78,52.14 5.12,51.81 v5.12,50.11
LED3  (via drill 0.35)
  Top 0.254: LED4.A v27.98,40.96 | IC2.23 v29.25,42.34
  Bottom 0.254: v29.25,42.34 28.84,42.34 27.98,41.47 v27.98,40.96
LED4  (via drill 0.35)
  Top 0.254: v38.26,53.44 38.26,55.07 IC2.9
  Bottom 0.254: LED5.A 38.22,53.4 v38.26,53.44
LED_IN  (via drill 0.35)
  Top 0.254: U$8.1 v13.5,40.01 | IC2.16 v29.35,51.23 | v27.98,49.09 v29.5,49.09
  Bottom 0.254: v13.5,40.01 14.26,40.01 15.02,40.78 15.02,47.82 15.53,48.33 27.21,48.33 v27.98,49.09 | v29.5,49.09 29.35,49.25 v29.35,51.23
LED_OUT  (via drill 0.35)
  Top 0.254: R23.2 v5.12,40.96
  Bottom 0.254: v5.12,40.96 3.92,42.17 3.92,44.12 3.51,44.52 J2.12
N$1
  Top 0.254: R2.2 LED2.C
N$2  (via drill 0.35)
  Top 0.254: R1.2 v38.65,33.09 | LED1.C v37.12,31.57
  Bottom 0.254: v38.65,33.09 38.65,32.07 38.14,31.57 v37.12,31.57
N$3  (via drill 0.35)
  Top 0.254: v33.31,32.84 33.06,33.09 R45.2 | L5.1 v34.58,31.57
  Bottom 0.254: v34.58,31.57 34.07,31.57 33.31,32.33 v33.31,32.84
N$4
  Top 0.254: R6.2 LED3.C
N$5
  Top 0.254: Q1.1 17.38,48.84 R4.2
N$6  (via drill 0.35)
  Top 0.254: IC2.24 v29.25,41.07 | R19.2 v28.49,38.93
  Bottom 0.254: v29.25,41.07 28.69,41.07 28.58,40.96 28.58,40.71 28.49,40.61 v28.49,38.93
N$7
  Top 0.254: R5.2 LED4.C
N$8
  Top 0.254: Q2.1 21.73,51.12 22.39,51.12 22.64,50.87 22.64,49.53 R22.2
N$9  (via drill 0.35)
  Top 0.254: R9.2 v38.14,17.6 | U2.6 v38.14,24.33
  Bottom 0.254: v38.14,24.33 37.38,23.56 37.38,18.36 v38.14,17.6
N$10  (via drill 0.35)
  Top 0.254: v20.17,79.93 19.37,79.93 CR1.1 19.41,78.66 v20.17,78.66 | v23.98,82.47 23.98,81.46 24.05,81.46 R29.1 25.25,81.67 v25.25,82.47
  pour Route15 (no thermals): 26.45,87.19 23.15,87.19 22.39,86.43 22.39,82.37 22.14,82.11 18.32,82.11 17.82,81.6 17.82,78.56 18.32,78.05 22.14,78.05 23.15,79.06 23.15,80.08 24.42,81.35 26.45,81.35 27.21,82.11 27.21,86.43
N$11
  Top 0.254: U$8.3 R23.1
N$12  (via drill 0.35)
  Top 0.254: v17.12,68.25 17.12,67.35 L2.4 15.6,67.29 v15.6,68.25 | L3.1 29.21,85.93 29.57,86.28 v30.59,86.28 | L3.1 30.18,85.01 v30.59,85.01 | L3.1 29.78,83.49 v30.59,83.49 | L3.1 29.21,82.57 29.82,81.96 v30.59,81.96
  pour Route15 (no thermals): 27.79,78.66 27.79,87.04 31.09,87.04 31.09,79.68 28.05,76.63 27.54,76.63 27.54,67.99 27.28,67.74 24.24,67.74 22.71,69.26 19.16,69.26 16.87,66.98 14.07,66.98 14.07,68.76 15.85,70.53 24.49,70.53 26.01,72.06 26.01,76.88
N$13  (via drill 0.35)
  Top 0.254: R17.2 v42.96,17.6 | U2.7 v38.14,25.6
  Bottom 0.254: v38.14,25.6 38.42,25.6 38.65,25.82 43.37,25.82 43.98,25.22 43.98,18.61 v42.96,17.6
N$14  (via drill 0.35)
  Top 0.254: v15.6,64.95 15.6,64.29 L2.3 17.12,64.35 v17.12,64.95 | L4.1 19.21,67.04 19.41,67.23 v20.68,67.23 | L4.1 20.14,65.96 v20.68,65.96 | L4.1 19.21,64.89 19.66,64.44 v20.68,64.44
  pour Route15 (no thermals): 17.05,66.36 15.02,66.36 15.02,63.57 22.14,63.57 23.91,65.35 28.99,65.35 30.52,66.87 30.52,76.27 30.01,76.78 28.99,76.78 28.49,76.27 28.49,67.63 27.98,67.13 24.17,67.13 22.64,68.65 19.34,68.65
N$15
  Top 0.254: U$2.3 R33.1
N$16  (via drill 0.35)
  Top 0.254: R3.2 v42.96,79.57 44.21,79.57 R25.1 | MOSFET1.4 v34.84,84.25
  Bottom 0.254: v42.96,79.57 36.61,79.57 36.06,80.12 36.06,83.6 35.41,84.25 v34.84,84.25
N$17  (via drill 0.35)
  Top 0.254: C15.1 37.12,79.73 v37.12,80.84 | L1.1 v43.29,84.05 | L1.1 42.27,84.34 42.27,86.03 v43.29,86.03 | L1.1 42.27,83.76 42.27,81.96 v43.29,81.96 | v39.22,83.3 MOSFET1.2 v37.44,83.3
  Bottom 0.254: v37.44,83.3 37.44,81.16 v37.12,80.84
  pour Route15: 40.93,87.7 43.47,87.7 43.73,87.45 43.73,81.1 41.44,81.1 39.91,82.62 36.87,82.62 36.87,83.38 39.66,83.38 40.93,84.65
N$18  (via drill 0.35)
  Top 0.254: C15.2 34.37,79.53 v34.33,79.57 | MOSFET1.6 34.86,82.35 v34.84,82.37
  Bottom 0.254: v34.33,79.57 34.33,81.85 v34.84,82.37
N$19  (via drill 0.35)
  Top 0.254: R20.2 v32.55,17.6 | U2.4 v30.01,23.06
  Bottom 0.254: v30.01,23.06 30.01,22.17 32.3,19.88 32.3,17.85 v32.55,17.6
N$20  (via drill 0.35)
  Top 0.254: U$4.3 31.79,11.58 31.79,13.79 v32.04,14.04 | R35.2 v32.55,15.31 | U2.2 v30.01,25.6 | U2.3 v30.01,24.33
  Bottom 0.254: v32.04,14.04 32.55,14.55 v32.55,15.31 32.55,16.33 31.79,17.09 31.79,19.63 29.25,22.17 29.25,23.56 v30.01,24.33 v30.01,25.6
N$21
  Top 0.254: U$1.5 49.38,23.98 R26.2
N$22  (via drill 0.35)
  Top 0.254: U$1.2 v51.85,29.28 | R28.1 49.8,32.58 v51.09,32.58 51.14,32.53 R27.2
  Bottom 0.254: v51.09,32.58 51.09,30.04 v51.85,29.28
N$23  (via drill 0.35)
  Top 0.254: IC3.6 25.33,9.33 25.18,9.47 24.17,9.47 24.03,9.33 IC3.4 v24.03,7.44 | R51.2 v22.9,7.94 | Q5.2 v14.01,27.64
  Bottom 0.254: v24.03,7.44 23.41,7.44 v22.9,7.94 21.12,7.94 20.1,8.96 20.1,26.74 19.2,27.64 v14.01,27.64
N$24  (via drill 0.35)
  Top 0.254: U$4.1 v30.58,7.94 | R37.1 v42.96,25.22
  Bottom 0.254: v30.58,7.94 31.35,7.18 37.34,7.18 37.95,7.8 37.95,11.1 42.02,15.16 42.02,24.56 42.67,25.22 v42.96,25.22
N$25  (via drill 0.35)
  Top 0.254: U$12.5 53.14,76.27 v53.88,76.27 | v56.43,78.05 R43.2
  Bottom 0.254: v53.88,76.27 53.88,77.22 54.72,78.05 v56.43,78.05
N$26  (via drill 0.35)
  Top 0.254: v41.03,52.25 40.27,51.49 v39.82,51.49
  Bottom 0.254: LED5.C 39.82,52.15 v39.82,51.49 | R21.2 v41.03,52.25
N$27  (via drill 0.35)
  Top 0.254: IC4.6 25.33,16.69 25.18,16.83 24.17,16.83 24.03,16.69 IC4.4 v24.03,14.8 | R50.2 v22.9,15.31 | Q5.4 v14.01,30.18
  Bottom 0.254: v24.03,14.8 23.41,14.8 v22.9,15.31 20.71,17.49 20.71,29.28 19.81,30.18 v14.01,30.18
N$30  (via drill 0.35)
  Top 0.254: R48.1 52.62,67.13 v52.11,67.63 | U$12.2 50.09,67.62 v50.1,67.61 | R44.2 48.79,67.62 v48.8,67.63
  Bottom 0.254: v52.11,67.63 52.08,67.61 v50.1,67.61 50.08,67.63 v48.8,67.63
N$31  (via drill 0.35)
  Top 0.254: IC5.6 25.33,30.41 25.18,30.55 24.17,30.55 24.03,30.41 IC5.4 v24.03,28.52 | R52.2 v22.9,29.03 | Q3.4 v14.01,36.59
  Bottom 0.254: v24.03,28.52 23.41,28.52 v22.9,29.03 21.63,30.3 21.63,33.09 18.12,36.59 v14.01,36.59
N$32  (via drill 0.35)
  Top 0.254: S3.2 v38.65,67.51 | R30.2 v38.39,71.19
  Bottom 0.254: v38.65,67.51 38.26,67.51 37.88,67.89 37.88,70.68 v38.39,71.19
N$34  (via drill 0.35)
  Top 0.254: S3.3 v38.65,66.24 | R31.2 v34.33,65.6
  Bottom 0.254: v34.33,65.6 34.96,66.24 v38.65,66.24
N$35  (via drill 0.35)
  Top 0.254: S3.4 v38.65,64.97 | R32.2 v36.87,65.6
  Bottom 0.254: v36.87,65.6 38.01,65.6 v38.65,64.97
N$36
  Top 0.254: LED7.C R14.2
N$37
  Top 0.254: LED8.C R10.2
N$42
  Top 0.254: LED9.C R16.2
PMIC_DIA  (via drill 0.35)
  Top 0.254: R31.1 34.07,62.11 v34.07,60.52 | v43.98,58.74 v43.98,56.76 | v33.31,36.39 33.31,38.2 IC2.26
  Bottom 0.254: v34.07,60.52 34.07,60.27 43.22,60.27 43.98,59.51 v43.98,58.74 | v33.31,36.39 33.31,37.15 34.33,38.17 45.25,38.17 45.76,38.68 45.76,54.98 v43.98,56.76
PMIC_SEN  (via drill 0.35)
  Top 0.254: R32.1 36.61,62.11 v36.61,61.03 | v45,58.74 v45,56.77 | IC2.28 v35.93,36.39
  Bottom 0.254: v45,56.77 46.27,55.5 46.27,38.42 45.61,37.76 36.61,37.76 35.93,37.08 v35.93,36.39 | v45,58.74 45,59.51 43.73,60.78 36.87,60.78 v36.61,61.03
RTS  (via drill 0.35)
  Top 0.254: v21.63,49.85 21.63,48.65 R22.1 v21.69,47.31 | Q1.2 v19.28,52.39
  Bottom 0.254: v21.69,47.31 23.41,47.31 23.91,46.81 X1.5 | v21.63,49.85 21.63,51.89 21.12,52.39 v19.28,52.39
RXD0  (via drill 0.35)
  Top 0.254: U2.1 v30.01,26.87 | v32.55,30.3 R8.2 | LED8.A v18.83,42.74 | v32.78,47.06 36.11,47.06 43.55,39.62 IC2.34 v43.55,36.39
  Bottom 0.254: v32.78,47.06 31.79,47.06 27.21,42.49 19.09,42.49 v18.83,42.74 X1.3 | v43.55,36.39 43.55,36.23 44.3,35.48 44.3,29.39 44.05,29.13 34.65,29.13 33.48,30.3 v32.55,30.3 30.99,30.3 30.01,29.32 v30.01,26.87
SCL  (via drill 0.35)
  Top 0.254: IC2.36 v46.09,36.39 | v56.65,15.56 | v56.65,15.56 R12.2
  Bottom 0.254: v46.09,36.39 46.09,20.06 49.06,17.09 55.66,17.09 56.65,16.1 v56.65,15.56 56.65,10.97 55.03,9.34 U$3.J2.1 45.88,9.34 37.16,0.62 13.63,0.62 7.72,6.53 7.72,10.34 6.56,11.5 J2.25
SDA  (via drill 0.35)
  Top 0.254: R15.2 49.12,15.82 v45.5,15.82 | IC2.33 v42.28,36.39
  Bottom 0.254: v42.28,36.39 42.89,37 45.07,37 45.17,36.9 45.25,36.9 45.48,36.67 45.48,36.14 45.5,36.12 v45.5,15.82 45.5,11.86 | U$3.J2.2 47.17,11.82 47.13,11.86 45.5,11.86 | 45.5,11.86 45.5,9.98 36.61,1.09 13.93,1.09 8.49,6.53 8.49,11.35 5.8,14.04 J2.24
SOLENOID  (via drill 0.35)
  Top 0.254: IC6.6 25.33,23.8 25.18,23.95 24.17,23.95 24.03,23.8 IC6.4 v24.03,21.91 | R53.2 v22.9,22.42 | Q3.2 13.02,34.11 v14.01,34.11
  Bottom 0.254: v24.03,21.91 23.41,21.91 v22.9,22.42 21.12,24.2 21.12,32.58 19.59,34.11 v14.01,34.11
TXD0  (via drill 0.35)
  Top 0.254: R36.1 v38.9,22.68 | R37.2 v38.9,25.22 38.9,25.98 v39.41,26.49 | LED7.A v16.29,42.74 | v44.82,39.95 IC2.35 v44.82,36.39 | v32.6,46.04 36.26,46.04 v41.14,41.17
  Bottom 0.254: v38.9,22.68 v38.9,25.22 | X1.2 v16.29,42.74 17.05,41.98 27.47,41.98 31.53,46.04 v32.6,46.04 | v41.14,41.17 44.44,41.17 44.82,40.79 v44.82,39.95 | v39.41,26.49 44.23,26.49 45,27.25 45,36.22 v44.82,36.39
VIN  (via drill 0.35)
  Top 0.254: v8.99,68.25 8.99,67.39 L2.1 10,66.72 10.52,66.72 v10.52,68.25 | v23.98,76.38 23.98,77.65 24.07,77.65 R29.2 25.25,77.42 v25.25,76.38
  pour Route15 (no thermals): 25.44,80.59 24.17,80.59 23.66,80.08 23.66,78.81 21.88,77.03 21.88,75 18.58,72.46 11.97,72.46 8.67,69.16 8.67,67.63 11.97,67.63 15.53,71.19 21.12,71.19 21.88,71.95 23.41,71.95 25.44,73.98 25.44,77.03 25.95,77.54 25.95,80.08
VIN1  (via drill 0.35)
  Top 0.254: v4.36,78.05 4.36,77.37 R24.1 5.12,77.31 v5.12,78.05
  pour Route15 (no thermals): 3.34,75.25 3.34,71.19 -0.22,71.19 -0.22,78.81 8.16,87.19 11.21,87.19 12.58,85.83 12.58,81.23 7.37,76.02 5.62,76.02 4.86,75.25
WATER_PUMP_OUT
  pour Top (no thermals): 9.18,28.01 10.71,28.01 10.96,27.76 10.96,26.23 10.71,25.98 4.02,25.98 3.66,26.34 3.66,33.2 3.48,33.38 -0.47,33.38 -0.4,33.45 -0.4,35.23 -0.38,35.25 2.88,35.25 4.42,33.7 4.42,28.62 4.93,28.12
WATER_PUMP_SIGNAL_OUT  (via drill 0.35)
  Top 0.254: IC3.2 24.68,11.34 v24.52,11.5 | R41.2 v22.9,10.74 | IC2.12 v34.66,53.41 | v34.66,43.76 v34.66,41.73 | v15.09,12.88 v20.71,12.88
  Bottom 0.254: v34.66,53.41 v34.66,43.76 | v34.66,41.73 34.66,40.71 26.96,33.01 26.96,14.15 25.69,12.88 24.49,12.88 | J2.21 1.04,21.66 0.38,21 0.38,15.9 0.87,15.42 6.2,15.42 8.7,12.91 15.06,12.91 v15.09,12.88 | v20.71,12.88 24.49,12.88 | v22.9,10.74 23.05,10.89 23.91,10.89 v24.52,11.5 24.52,12.85 24.49,12.88
WATER_SOLENOID_OUT
  pour Top (no thermals): 2.9,40.31 -0.47,40.31 -0.47,38.02 2.9,38.02 5.19,35.48 5.95,34.72 5.95,32.43 8.59,32.33 10.96,32.33 10.96,34.11 10.71,34.36 8.59,34.36 6.71,34.47 6.71,35.23 3.66,38.28 3.66,39.55
WATER_SOLENOID_SIGNAL_OUT  (via drill 0.35)
  Top 0.254: IC6.2 24.68,25.82 v24.52,25.98 | R49.2 v22.9,25.22 | IC2.13 v33.39,53.41 | v26.2,34.36 v26.2,32.58 | v9.4,24.45 v9.4,16.6 | v18.58,26.99 v22.9,26.99
  Bottom 0.254: v33.39,53.41 33.39,42.57 26.2,35.38 v26.2,34.36 | v26.2,32.58 26.2,27.25 25.95,26.99 24.49,26.99 | 24.49,26.99 v22.9,26.99 | v9.4,24.45 16.04,24.45 v18.58,26.99 | v9.4,16.6 6.1,16.6 6.08,16.58 J2.23 | v22.9,25.22 23.81,25.22 24.32,25.73 24.32,25.78 v24.52,25.98 24.49,26.01 24.49,26.99

### Text on the board
tPlace: Vega_Innovations | Drip_Irrigation | V2 | Made In Sri_Lanka
bPlace: Vega_Innovations | Drip_Irrigation | Made In Sri_Lanka
tNames: +12VIN | GND_Sup | 12V_OUT | 5V_OUT | EMT_LEVL | FLD_LEVL | RST_BTN | FLW_SEN | LED 2 | 3.3V OUT | GND OUT | LED 1 | BUZZER | SOLIN | FTI_PUMP | WTR_PUMP | BUTTON1 | BUTTON2 | RS485 A | RS485 B | W_PMP_BT | F_PMP_BT | SOLE_BT | SDA | SCL